# Altium project RetroClock-PCBMAIN.PrjPcb (part 1 of 2)
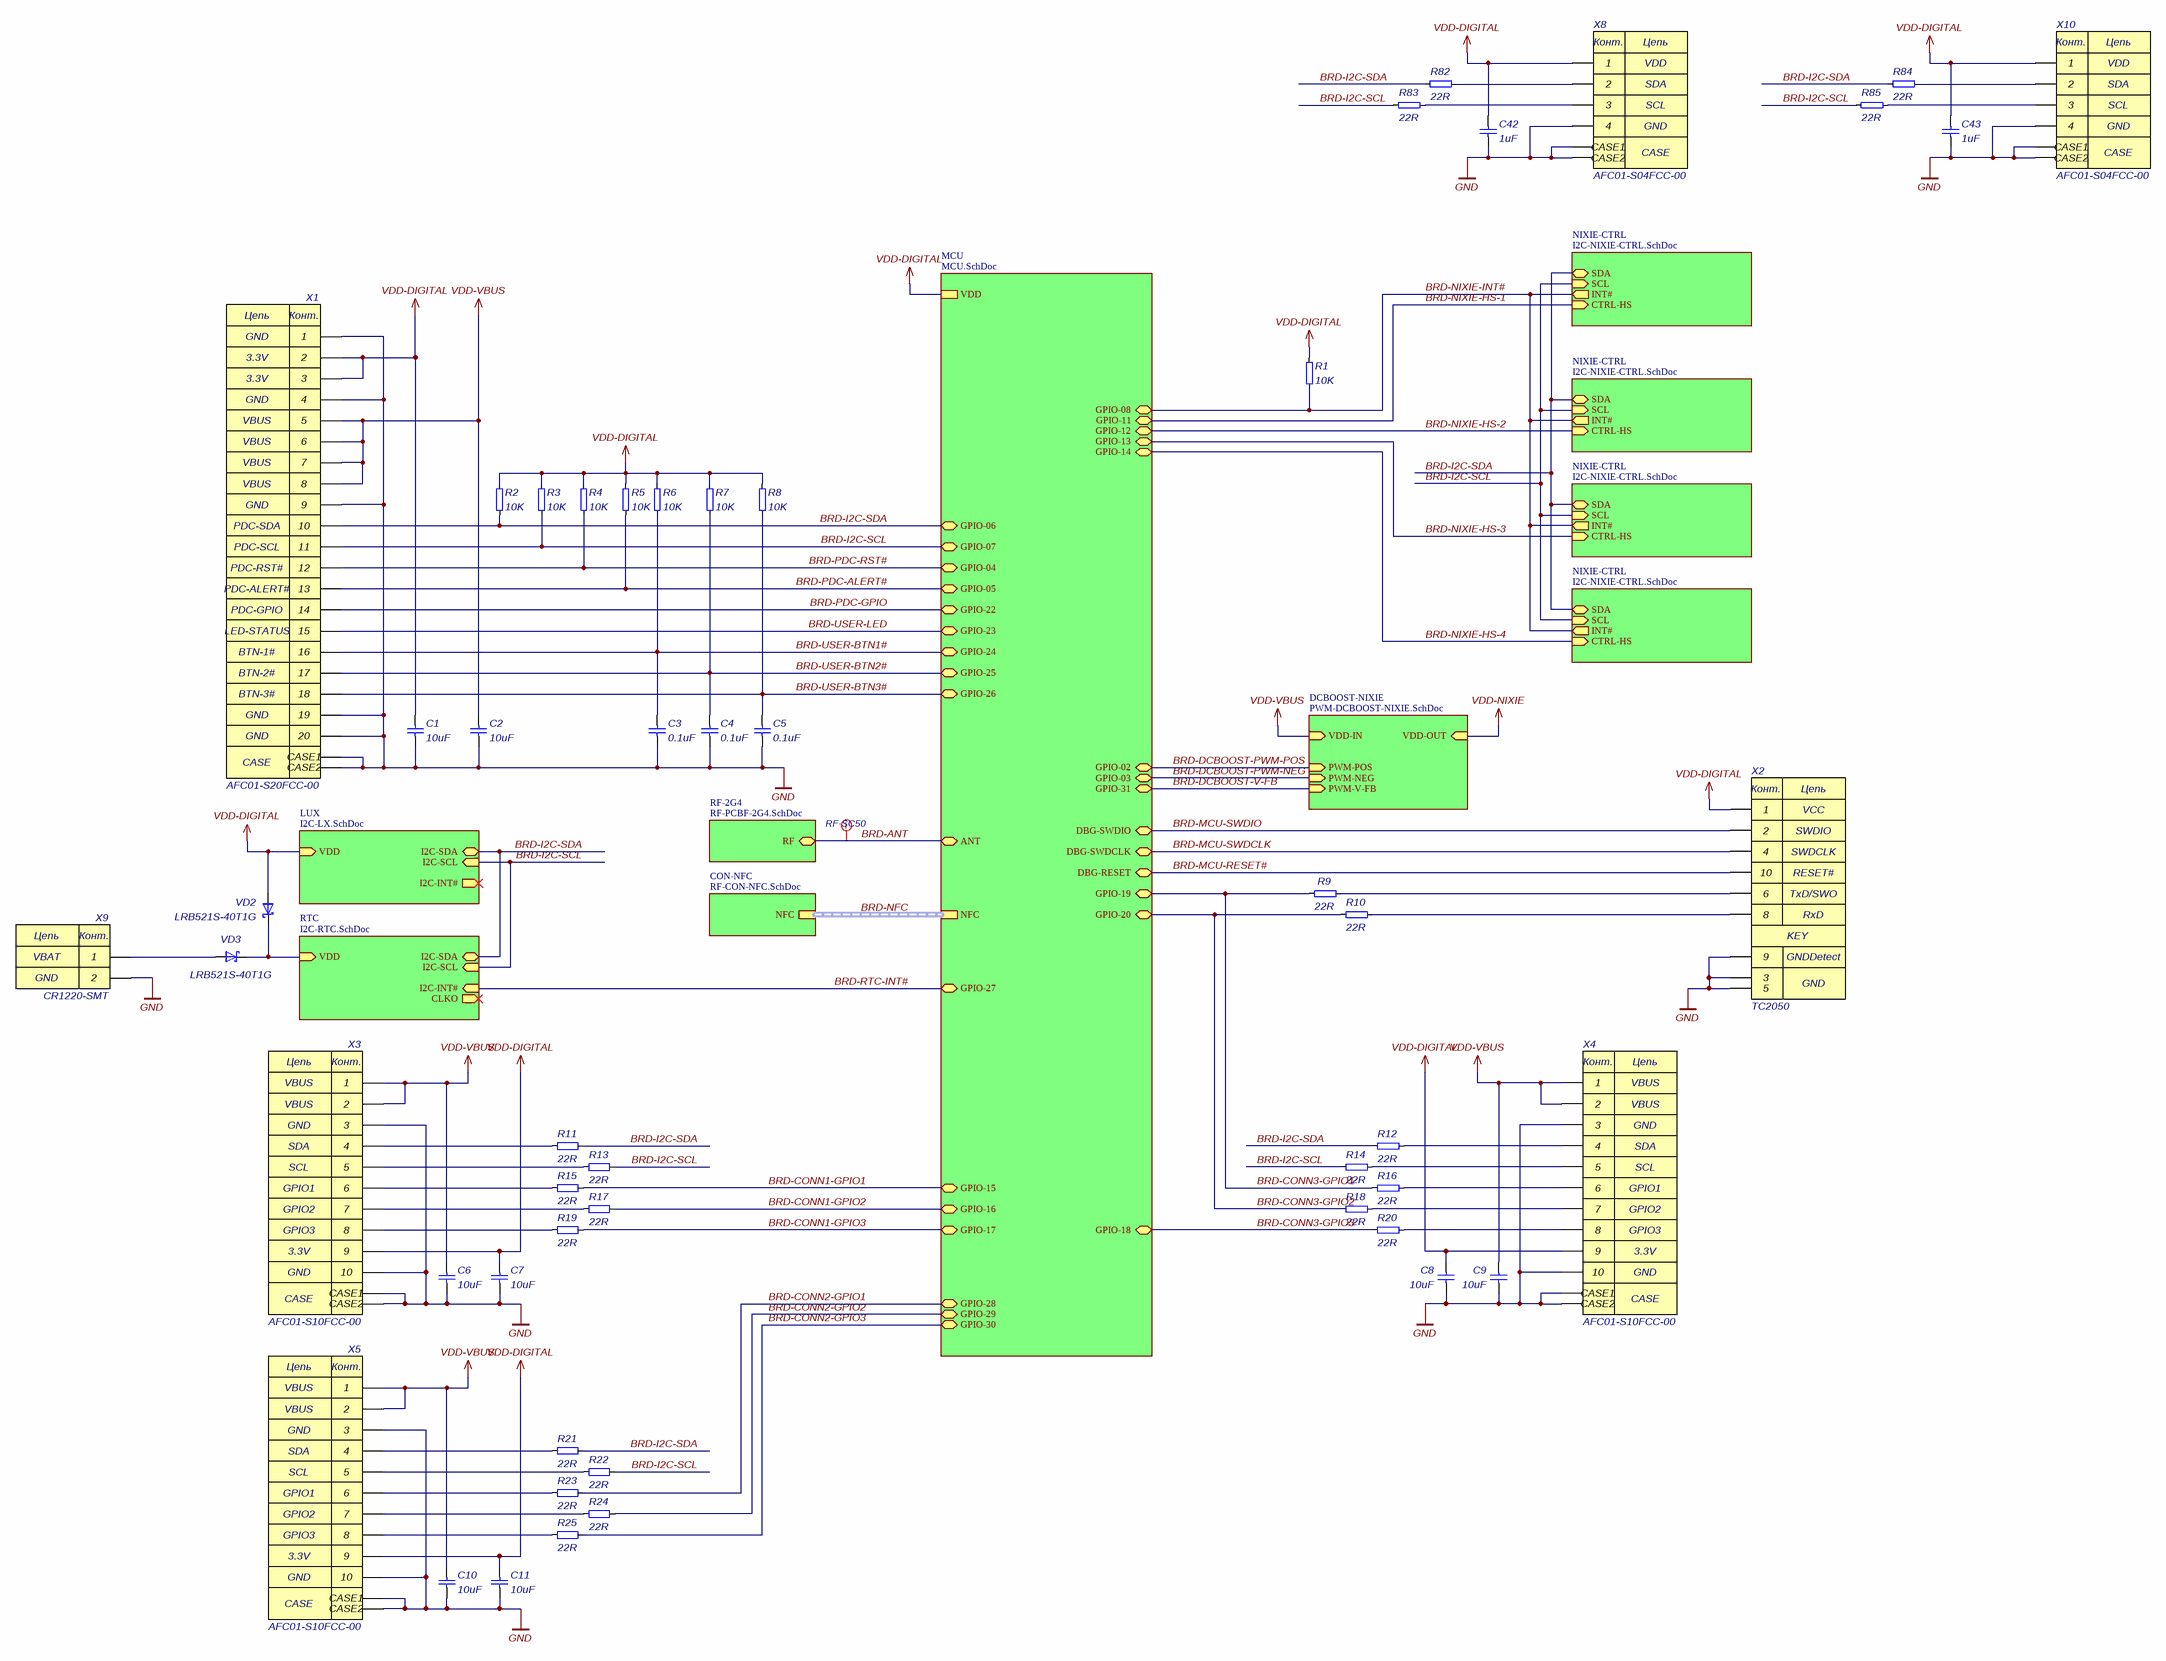
[diagram p0: Board.SchDoc]
ProjectBoardInterface: PRJ; ProjectBoardName: PCBMAIN; ProjectDocumentDescription: Основная плата управления часов с ГРИ; ProjectNumber: RETROCLOCK; ProjectRevision: 1.0; ProjectRevisionCode: A1S3
9 sheets, 364 parts. Net scope: hierarchical (ports join the sheet entries above them; power ports are global).
Board file: PCBMAIN.PcbDoc
Sheets:
  Board.SchDoc
    MCU = MCU.SchDoc
    LUX = I2C-LX.SchDoc
    RTC = I2C-RTC.SchDoc
    NIXIE-CTRL = I2C-NIXIE-CTRL.SchDoc
      EXPANDER = I2C-EXPANDER.SchDoc
    NIXIE-CTRL = I2C-NIXIE-CTRL.SchDoc
      EXPANDER = I2C-EXPANDER.SchDoc
    NIXIE-CTRL = I2C-NIXIE-CTRL.SchDoc
      EXPANDER = I2C-EXPANDER.SchDoc
    NIXIE-CTRL = I2C-NIXIE-CTRL.SchDoc
      EXPANDER = I2C-EXPANDER.SchDoc
    DCBOOST-NIXIE = PWM-DCBOOST-NIXIE.SchDoc
    RF-2G4 = RF-PCBF-2G4.SchDoc
    CON-NFC = RF-CON-NFC.SchDoc

## Sheet Board.SchDoc: =ProjectTitle
size 594 x 420 mm; Address1: Address1; Address2: Address2; Address3: Address3; Address4: Address4; DocumentNumber: PRJ-RETROCLOCK-PCBMAIN-1.0 Э3; SheetNumber: 1; SheetTotal: 9; Scale: 1:1; DocumentType: Схема электрическая принципиальная; FirstReferrence: RETROCLOCK

### Parts
C1  10uF  [C0805]
C2  10uF  [C0805]
C3  0.1uF  [C0402]
C4  0.1uF  [C0402]
C5  0.1uF  [C0402]
C6  10uF  [C0805]
C7  10uF  [C0805]
C8  10uF  [C0805]
C9  10uF  [C0805]
C10  10uF  [C0805]
C11  10uF  [C0805]
C42  1uF  [C0402]
C43  1uF  [C0402]
R1  10K  [R_0402]
R2  10K  [R_0402]
R3  10K  [R_0402]
R4  10K  [R_0402]
R5  10K  [R_0402]
R6  10K  [R_0402]
R7  10K  [R_0402]
R8  10K  [R_0402]
R9  22R  [R_0402]
R10  22R  [R_0402]
R11  22R  [R_0402]
R12  22R  [R_0402]
R13  22R  [R_0402]
R14  22R  [R_0402]
R15  22R  [R_0402]
R16  22R  [R_0402]
R17  22R  [R_0402]
R18  22R  [R_0402]
R19  22R  [R_0402]
R20  22R  [R_0402]
R21  22R  [R_0402]
R22  22R  [R_0402]
R23  22R  [R_0402]
R24  22R  [R_0402]
R25  22R  [R_0402]
R82  22R  [R_0402]
R83  22R  [R_0402]
R84  22R  [R_0402]
R85  22R  [R_0402]
VD2  LRB521S-40T1G  [SOD-523]
VD3  LRB521S-40T1G  [SOD-523]
X1  AFC01-S20FCC-00  [505110-2096]
X2  TC2050  [TC2050-IDC-FP]  (no BOM)
X3  AFC01-S10FCC-00  [505110-1096]
X4  AFC01-S10FCC-00  [505110-1096]
X5  AFC01-S10FCC-00  [505110-1096]
X8  AFC01-S04FCC-00  [505110-0492]
X9  CR1220-SMT  [BAT-HLDR-CR1220-SMT]
X10  AFC01-S04FCC-00  [505110-0492]

### Sub-sheets
CON-NFC = RF-CON-NFC.SchDoc: NFC (harness NFC)
DCBOOST-NIXIE = PWM-DCBOOST-NIXIE.SchDoc: VDD-IN (in), PWM-POS (in), PWM-NEG (in), VDD-OUT (in), PWM-V-FB (in)
LUX = I2C-LX.SchDoc: I2C-SDA (bidir), I2C-SCL (in), VDD (in), I2C-INT# (out)
MCU = MCU.SchDoc: VDD, NFC (harness NFC), ANT (bidir), GPIO-06 (bidir), GPIO-07 (bidir), GPIO-08 (bidir), GPIO-11 (bidir), GPIO-04 (bidir), GPIO-05 (bidir), GPIO-22 (bidir), GPIO-23 (bidir), GPIO-24 (bidir), GPIO-25 (bidir), GPIO-26 (bidir), GPIO-02 (bidir), GPIO-03 (bidir), GPIO-31 (bidir), GPIO-27 (bidir), GPIO-12 (bidir), GPIO-13 (bidir), GPIO-14 (bidir), GPIO-15 (bidir), GPIO-16 (bidir), GPIO-17 (bidir), GPIO-18 (bidir), GPIO-28 (bidir), GPIO-29 (bidir), GPIO-30 (bidir), DBG-SWDIO (bidir), DBG-SWDCLK (bidir), DBG-RESET (bidir), GPIO-19 (bidir), GPIO-20 (bidir)
NIXIE-CTRL = I2C-NIXIE-CTRL.SchDoc: INT# (out), SDA (bidir), SCL (in), CTRL-HS (in)
NIXIE-CTRL = I2C-NIXIE-CTRL.SchDoc: INT# (out), SDA (bidir), SCL (in), CTRL-HS (in)
NIXIE-CTRL = I2C-NIXIE-CTRL.SchDoc: INT# (out), SDA (bidir), SCL (in), CTRL-HS (in)
NIXIE-CTRL = I2C-NIXIE-CTRL.SchDoc: INT# (out), SDA (bidir), SCL (in), CTRL-HS (in)
RF-2G4 = RF-PCBF-2G4.SchDoc: RF (bidir)
RTC = I2C-RTC.SchDoc: I2C-SDA (bidir), I2C-SCL (in), VDD (in), I2C-INT# (in), CLKO (out)

### Nets
GND: C1.2 C2.2 C3.1 C4.1 C5.1 C6.2 C7.2 C8.2 C9.2 C10.2 C11.2 C42.1 C43.1 X1.1 X1.4 X1.9 X1.19 X1.20 X1.CASE1 X1.CASE2 X2.3 X2.5 X2.9 X3.3 X3.10 X3.CASE1 X3.CASE2 X4.3 X4.10 X4.CASE1 X4.CASE2 X5.3 X5.10 X5.CASE1 X5.CASE2 X8.4 X8.CASE1 X8.CASE2 X9.2 X10.4 X10.CASE1 X10.CASE2
VDD-DIGITAL: C1.1 C7.1 C8.1 C11.1 C42.2 C43.2 R1.1 R2.1 R3.1 R4.1 R5.1 R6.1 R7.1 R8.1 VD2.2(A) X1.2 X1.3 X2.1 X3.9 X4.9 X5.9 X8.1 X10.1 ; sheet MCU/VDD, sheet LUX/VDD
VDD-RTC: VD2.1(K) VD3.1(K) ; sheet RTC/VDD
VDD-VBUS: C2.1 C6.1 C9.1 C10.1 X1.5 X1.6 X1.7 X1.8 X3.1 X3.2 X4.1 X4.2 X5.1 X5.2 ; sheet DCBOOST-NIXIE/VDD-IN
BRD-ANT: sheet MCU/ANT, sheet RF-2G4/RF
BRD-CONN1-GPIO1: R15.2 ; sheet MCU/GPIO-15
BRD-CONN1-GPIO2: R17.2 ; sheet MCU/GPIO-16
BRD-CONN1-GPIO3: R19.2 ; sheet MCU/GPIO-17
BRD-CONN2-GPIO1: R23.2 ; sheet MCU/GPIO-28
BRD-CONN2-GPIO2: R24.2 ; sheet MCU/GPIO-29
BRD-CONN2-GPIO3: R25.2 ; sheet MCU/GPIO-30
BRD-CONN3-GPIO1: R9.2 R16.2 ; sheet MCU/GPIO-19
BRD-CONN3-GPIO2: R10.2 R18.2 ; sheet MCU/GPIO-20
BRD-CONN3-GPIO3: R20.2 ; sheet MCU/GPIO-18
BRD-DCBOOST-PWM-NEG: sheet MCU/GPIO-03, sheet DCBOOST-NIXIE/PWM-NEG
BRD-DCBOOST-PWM-POS: sheet MCU/GPIO-02, sheet DCBOOST-NIXIE/PWM-POS
BRD-DCBOOST-V-FB: sheet MCU/GPIO-31, sheet DCBOOST-NIXIE/PWM-V-FB
BRD-I2C-SCL: R3.2 R13.2 R14.2 R22.2 R83.2 R85.2 X1.11 ; sheet MCU/GPIO-07, sheet LUX/I2C-SCL, sheet RTC/I2C-SCL, sheet NIXIE-CTRL/SCL, sheet NIXIE-CTRL/SCL, sheet NIXIE-CTRL/SCL, sheet NIXIE-CTRL/SCL
BRD-I2C-SDA: R2.2 R11.2 R12.2 R21.2 R82.2 R84.2 X1.10 ; sheet MCU/GPIO-06, sheet LUX/I2C-SDA, sheet RTC/I2C-SDA, sheet NIXIE-CTRL/SDA, sheet NIXIE-CTRL/SDA, sheet NIXIE-CTRL/SDA, sheet NIXIE-CTRL/SDA
BRD-MCU-RESET#: X2.10 ; sheet MCU/DBG-RESET
BRD-MCU-SWDCLK: X2.4 ; sheet MCU/DBG-SWDCLK
BRD-MCU-SWDIO: X2.2 ; sheet MCU/DBG-SWDIO
BRD-NIXIE-HS-1: sheet MCU/GPIO-11, sheet NIXIE-CTRL/CTRL-HS
BRD-NIXIE-HS-2: sheet MCU/GPIO-12, sheet NIXIE-CTRL/CTRL-HS
BRD-NIXIE-HS-3: sheet MCU/GPIO-13, sheet NIXIE-CTRL/CTRL-HS
BRD-NIXIE-HS-4: sheet MCU/GPIO-14, sheet NIXIE-CTRL/CTRL-HS
BRD-NIXIE-INT#: R1.2 ; sheet MCU/GPIO-08, sheet NIXIE-CTRL/INT#, sheet NIXIE-CTRL/INT#, sheet NIXIE-CTRL/INT#, sheet NIXIE-CTRL/INT#
BRD-PDC-ALERT#: R5.2 X1.13 ; sheet MCU/GPIO-05
BRD-PDC-GPIO: X1.14 ; sheet MCU/GPIO-22
BRD-PDC-RST#: R4.2 X1.12 ; sheet MCU/GPIO-04
BRD-RTC-INT#: sheet MCU/GPIO-27, sheet RTC/I2C-INT#
BRD-USER-BTN1#: C3.2 R6.2 X1.16 ; sheet MCU/GPIO-24
BRD-USER-BTN2#: C4.2 R7.2 X1.17 ; sheet MCU/GPIO-25
BRD-USER-BTN3#: C5.2 R8.2 X1.18 ; sheet MCU/GPIO-26
BRD-USER-LED: X1.15 ; sheet MCU/GPIO-23
NetR9_1: R9.1 X2.6
NetR10_1: R10.1 X2.8
NetR11_1: R11.1 X3.4
NetR12_1: R12.1 X4.4
NetR13_1: R13.1 X3.5
NetR14_1: R14.1 X4.5
NetR15_1: R15.1 X3.6
NetR16_1: R16.1 X4.6
NetR17_1: R17.1 X3.7
NetR18_1: R18.1 X4.7
NetR19_1: R19.1 X3.8
NetR20_1: R20.1 X4.8
NetR21_1: R21.1 X5.4
NetR22_1: R22.1 X5.5
NetR23_1: R23.1 X5.6
NetR24_1: R24.1 X5.7
NetR25_1: R25.1 X5.8
NetR82_1: R82.1 X8.2
NetR83_1: R83.1 X8.3
NetR84_1: R84.1 X10.2
NetR85_1: R85.1 X10.3
NetVD3_2: VD3.2(A) X9.1

### Buses and harness runs
harness BRD-NFC = sheet CON-NFC/NFC = sheet MCU/NFC

### Layout directives
net class RF-SC50: BRD-ANT

### Notes on the sheet
- VDD
- GND
- SDA
- SCL
- 3.3V
- VBUS
- PDC-SDA
- PDC-SCL
- PDC-RST#
- (near X1) PDC-ALERT#
- PDC-GPIO
- (near X1) LED-STATUS
- BTN-1#
- BTN-2#
- BTN-3#
- VBAT
- GPIO1
- GPIO2
- GPIO3
- Перв. применение
- Справ. №
- Подп. и дата
- Инв. № дубл.
- Взам. инв. №
- File name: =DocumentName
  Variant name (Short): =ProjectVariant ( =ProjectBoardVariant )
  Version on board: =ProjectRevisionCode
- Разраб.
- Изм.
- Лист
- № докум.
- Подп.
- Дата
- Лит.
- Масса
- Масштаб
- Пров.
- Т.контр.
- =ProjectDocumentDescription
- Листов
- Инв. № подл.
- Утв.
- Н.контр.
- Копировал
- Формат А2
- (in symbol AFC01-S04FCC-00) Конт.; Цепь; CASE
- (in symbol AFC01-S10FCC-00) Цепь; Конт.; CASE
- (in symbol AFC01-S20FCC-00) Цепь; Конт.; CASE
- (in symbol L-KLS5-CR1220-02) Цепь; Конт.
- (in symbol PCB-TAGC-10PIN-SWD-UART) Конт.; Цепь; VCC; SWDIO; SWDCLK; RESET#; TxD/SWO; RxD; KEY; GNDDetect; GND

### Library data of the parts
C1 C2 C6-C11 = 0805-X5R-25V-10uF±10%: Manufacturer: Samsung; NameFromManufacturer: CL21A106KAYNNNE; Place: S; Voltage: 25V; Tolerance: 10%; Check: False; Part Number: 0805-X5R-25V-10uF±10%; Value: 10uF; Temperature: -55°C~85°C; ComponentLink2Description: Link to datasheet; ComponentLink1Description: DATASHEET; ComponentLink2URL: https://www.terraelectronica.ru/product/1640984; ComponentLink1URL: Datasheets/capacitors/MLCC-1837944.pdf; Last changed: 27.10.2022
C3-C5 = 0402-X5R-50V-0.1uF±10%: Manufacturer: Yageo; NameFromManufacturer: CC0402KRX5R9BB104; Place: S; Voltage: 50V; Tolerance: 10%; Check: False; Part Number: 0402-X5R-50V-0.1uF±10%; Value: 0.1uF; Temperature: -55°C~85°C; ComponentLink2Description: Link to datasheet; ComponentLink1Description: DATASHEET; ComponentLink2URL: https://www.yageo.com/upload/media/product/productsearch/datasheet/mlcc/UPY-GPHC_X5R_4V-to-50V_26.pdf; ComponentLink1URL: Datasheets/capacitors/UPY-GPHC_X5R_4V-to-50V_26.pdf; Last changed: 27.10.2022
C42 C43 = 0402-X5R-10V-01uF±10%: Manufacturer: Yageo; NameFromManufacturer: CC0402KRX5R6BB105; Place: S; Voltage: 10V; Tolerance: 10%; Check: False; Part Number: 0402-X5R-10V-01uF±10%; Value: 1uF; Temperature: -55°C~85°C; ComponentLink2Description: Link to datasheet; ComponentLink1Description: DATASHEET; ComponentLink2URL: https://ru.mouser.com/ProductDetail/YAGEO/CC0402KRX5R6BB105?qs=%2Fha2pyFadujgDGyIaqGI8b3%252BmgRHwq35%252Bnrnc96EVYSPd2LBZ%2FzpTg%3D%3D; ComponentLink1URL: Datasheets/capacitors/UPY-GPHC_X5R_4V-to-50V_27.pdf; Last changed: 27.10.2022
R1-R8 = 0402-0.0625W-10K-100ppm±1%: NameFromManufacturer: RC0402FR-0710KL; Manufacturer: Yageo; Place: S; Tolerance: 1%; Check: False; Part Number: 0402-0.0625W-10K-100ppm±1%; Value: 10K; Temperature: -55°C~155°C; ComponentLink1Description: DATASHEET; ComponentLink1URL: https://ru.mouser.com/ProductDetail/YAGEO/RC0402FR-0710KL?qs=%2Fha2pyFaduhjtLcYvKXQ8IogF7YwN7YtH%252BOO8ZtEEMnoa4yoWYcwpw%3D%3D; Datasheet: Datasheets/resistors/PYu-RC_Group_51_RoHS_L_11.pdf; Last changed: 27.10.2022
R9-R25 R82-R85 = 0402-0.0625W-22R-100ppm±1%: NameFromManufacturer: RC0402FR-0722RL; Manufacturer: Yageo; Place: S; Tolerance: 1%; Check: False; Part Number: 0402-0.0625W-22R-100ppm±1%; Value: 22R; Temperature: -55°C~155°C; ComponentLink1Description: DATASHEET; ComponentLink1URL: https://www.yageo.com/upload/media/product/productsearch/datasheet/rchip/PYu-RC_Group_51_RoHS_L_11.pdf; Datasheet: Datasheets/resistors/PYu-RC_Group_51_RoHS_L_11.pdf; Last changed: 27.10.2022
VD2 VD3 = LRB521S-40T1G: 40V 300mV 200mA SOD-523 Schottky Barrier Diode; Manufacturer: LRC; Place: T; Analog: NSVRB751S40T1G, 	SDM03U40Q-7; Check: False; Part Number: LRB521S-40T1G; Value: LRB521S-40T1G; Temperature: -55°C~125°C; ComponentLink1Description: DATASHEET; NameFromManufacturer: LRB521S-40T1G; ComponentLink1URL: https://www.lcsc.com/product-detail/Schottky-Barrier-Diodes-SBD_LRC-LRB521S-40T1G_C135802.html; Last changed: 13.03.2024
X1 = AFC01-S20FCC-00: Clamshell -25℃~+85℃ 20P Bottom Contact Surface Mount，Right Angle 0.5mm FFC/FPC Connector; Manufacturer: JUSHUO; Place: T; Check: False; Part Number: AFC01-S20FCC-00; Value: AFC01-S20FCC-00; Temperature: -25°C~85°C; ComponentLink1Description: DATASHEET; NameFromManufacturer: AFC01-S20FCC-00; ComponentLink1URL: https://www.lcsc.com/product-detail/FFC-FPC-Connectors_JUSHUO-AFC01-S20FCC-00_C262274.html; Last changed: 10.03.2024
X2 = PCB-TAGC-10PIN-SWD-UART: TAG Connect 10 pin ARM swd compatilbe with UART; Place: T; Check: False; Part Number: PCB-TAGC-10PIN-SWD-UART; Value: TC2050; ComponentLink1Description: DATASHEET; NameFromManufacturer: *
X3-X5 = AFC01-S10FCC-00: Clamshell -25℃~+85℃ 10P Bottom Contact Surface Mount，Right Angle 0.5mm FFC/FPC Connector; Manufacturer: JUSHUO; Place: T; Check: False; Part Number: AFC01-S10FCC-00; Value: AFC01-S10FCC-00; Temperature: -25°C~85°C; ComponentLink1Description: DATASHEET; NameFromManufacturer: AFC01-S10FCC-00; ComponentLink1URL: https://www.lcsc.com/product-detail/FFC-FPC-Connectors_JUSHUO-AFC01-S10FCC-00_C262266.html; Last changed: 11.03.2024
X8 X10 = AFC01-S04FCC-00: Clamshell 4P Bottom Contact Surface Mount, Right Angle 0.5mm, FFC/FPC Connector; Manufacturer: JUSHUO; Place: T; Check: False; Part Number: AFC01-S04FCC-00; Value: AFC01-S04FCC-00; Temperature: -25°C~85°C; ComponentLink1Description: DATASHEET; NameFromManufacturer: AFC01-S04FCC-00; ComponentLink1URL: https://www.lcsc.com/product-detail/FFC-FPC-Connectors_JUSHUO-AFC01-S04FCC-00_C262260.html; Last changed: 10.03.2024
X9 = L-KLS5-CR1220-02: Battery base -25℃~+85℃ CR1220 SMD Battery Connector; Place: T; Analog: XDCR-1220-006, BS-12-B3AA009; Check: False; Part Number: L-KLS5-CR1220-02; Value: CR1220-SMT; Temperature: -25°C~85°C; ComponentLink1Description: DATASHEET; NameFromManufacturer: L-KLS5-CR1220-02; ComponentLink1URL: https://klsele.com/products/Battery-Connectors-Battery-holders/Coin-Cell-Holders/4669.html; Last changed: 13.03.2024

## Sheet MCU.SchDoc: =ProjectTitle
size 297 x 209 mm; Address1: Address1; Address2: Address2; Address3: Address3; Address4: Address4; DocumentNumber: RETROCLOCK 1.0; SheetNumber: ?; SheetTotal: ?; Scale: 1:1; DocumentType: Схема электрическая принципиальная; FirstReferrence: RETROCLOCK; Title2str: ?
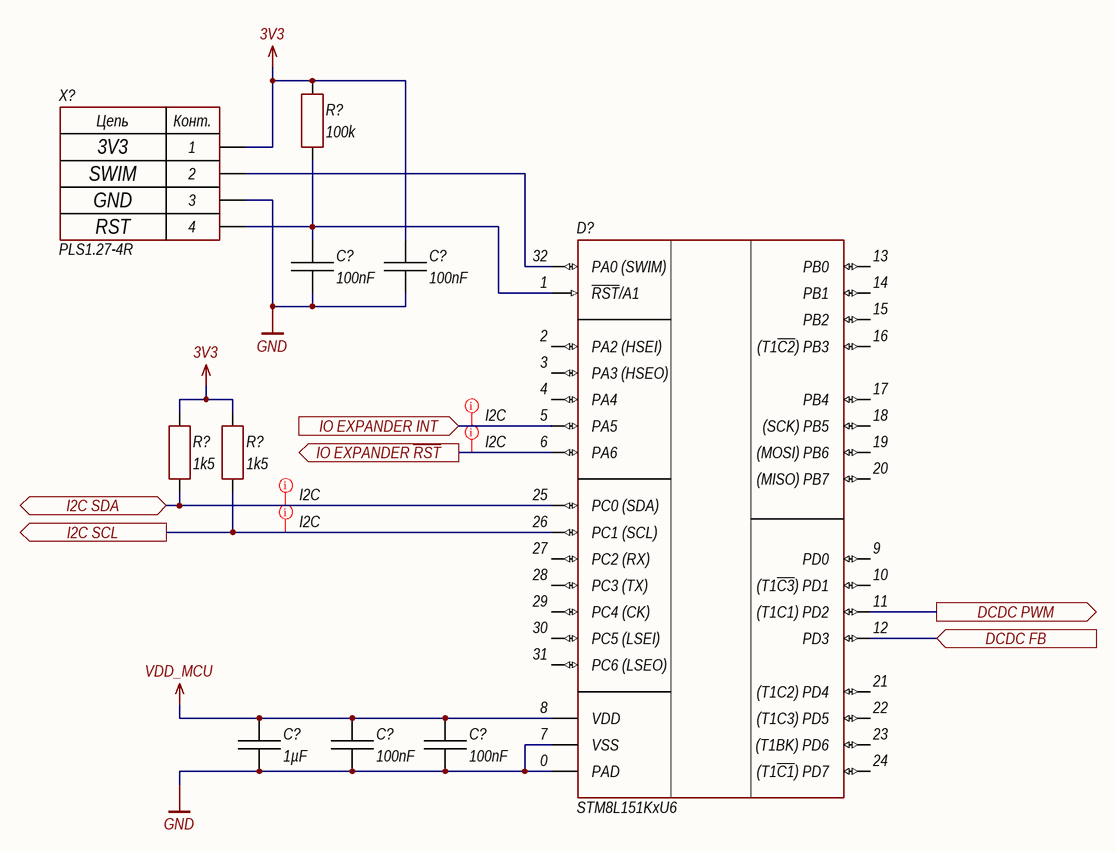
[diagram p1: MCU.SchDoc]

### Parts
(Parts that share a designator on the sheet are numbered #1, #2 ... from top to bottom, then left to right.)
C?#1  100nF  [CH0402C]
C?#2  100nF  [CH0402C]
C?#3  1µF  [CH0402C]
C?#4  100nF  [CH0402C]
C?#5  100nF  [CH0402C]
D?  STM8L151KxU6  [32-UFQFPN]
R?#1  100k  [CH0402R]
R?#2  1k5  [CH0402R]
R?#3  1k5  [CH0402R]
X?  PLS1.27-4R  [CON: PLS1.27-4R]

### Ports
DCDC FB (in), DCDC PWM (out), I2C SCL (out), I2C SDA (bidir), IO EXPANDER INT (in), IO EXPANDER ~{RST} (out)

### Nets
3V3: C?#2.2 R?#1.2 R?#2.2 R?#3.2 X?.1
GND: C?#1.1 C?#2.1 C?#3.1 C?#4.1 C?#5.1 D?.0(PAD) D?.7(VSS) X?.3
VDD_MCU: C?#3.2 C?#4.2 C?#5.2 D?.8(VDD)
DCDC FB: D?.12(PD3) ; port DCDC FB
DCDC PWM: D?.11((T1C1)_PD2) ; port DCDC PWM
I2C SCL: D?.26(PC1_(SCL)) R?#3.1 ; port I2C SCL
I2C SDA: D?.25(PC0_(SDA)) R?#2.1 ; port I2C SDA
IO EXPANDER INT: D?.5(PA5) ; port IO EXPANDER INT
IO EXPANDER ~{RST}: D?.6(PA6) ; port IO EXPANDER ~{RST}
NetC?#1_2: C?#1.2 D?.1(~{RST}/A1) R?#1.1 X?.4
NetD?_32: D?.32(PA0_(SWIM)) X?.2

Not connected (* = marked no-connect by the designer): D? 2(PA2_(HSEI)) 3(PA3_(HSEO)) 4(PA4) 9(PD0) 10((T1~{C3})_PD1) 13(PB0) 14(PB1) 15(PB2) 16((T1~{C2})_PB3) 17(PB4) 18((SCK)_PB5) 19((MOSI)_PB6) 20((MISO)_PB7) 21((T1C2)_PD4) 22((T1C3)_PD5) 23((T1BK)_PD6) 24((T1~{C1})_PD7) 27(PC2_(RX)) 28(PC3_(TX)) 29(PC4_(CK)) 30(PC5_(LSEI)) 31(PC6_(LSEO))

### Layout directives
net class I2C; rule Matched Net Lengths [Tolerance = 0.1mm]: I2C SCL, I2C SDA, IO EXPANDER INT
net class I2C: IO EXPANDER ~{RST}

### Notes on the sheet
- 3V3
- SWIM
- GND
- RST
- Утв.
- Н.контр.
- Т.контр.
- Пров.
- Разраб.
- Изм.
- Лист
- № докум.
- Подп.
- Дата
- Копировал
- Формат А4
- Лит.
- Листов
- Масса
- Масштаб
- (in symbol 4-Connector) Цепь; Конт.

### Library data of the parts
C?#1 C?#2 C?#4 C?#5 = Capacitor: Manufacturer: CCTC; Model: TCC0402X7R104K250AT; HelpURL: https://lcsc.com/product-detail/Multilayer-Ceramic-Capacitors-MLCC-SMD-SMT_CCTC-TCC0402X7R104K250AT_C466234.html; ComponentKind: X7R, 50V; Value: 100nF
C?#3 = Capacitor: Manufacturer: Samsung Electro-Mechanics; Model: CL05B105KQ5NQNC; HelpURL: https://lcsc.com/product-detail/Others_Samsung-Electro-Mechanics_CL05B105KQ5NQNC_Samsung-Electro-Mechanics-CL05B105KQ5NQNC_C307427.html; ComponentKind: X7R, 6.3V; Value: 1µF
D? = STM8L151KxU6: STM8; Manufacturer: ST Microelectronics; Model: STM8L151KxU6; ComponentKind: 1.8-3.6V, UFQFPN32; HelpURL: https://ru.mouser.com/datasheet/2/389/stm8l151c4-956418.pdf
R?#1 = Resistor: Manufacturer: Uniroyal Elec; Model: 0402WGF1003TCE; HelpURL: https://lcsc.com/product-detail/Chip-Resistor-Surface-Mount_UNI-ROYAL-Uniroyal-Elec-0402WGF1003TCE_C25741.html; ComponentKind: ±1%; Value: 100k
R?#2 R?#3 = Resistor: ComponentKind: ±1%; Value: 1k5
X? = 4-Connector: Model: PLS1.27-4R; Manufacturer: *; HelpURL: *; ComponentKind: *

## Sheet I2C-LX.SchDoc: =ProjectTitle
size 209 x 297 mm; Address1: Address1; Address2: Address2; Address3: Address3; Address4: Address4; DocumentNumber: PRJ-RETROCLOCK-PCBMAIN-1.0 Э3; SheetNumber: 3; SheetTotal: 9; Scale: 1:1; DocumentType: Схема электрическая принципиальная; FirstReferrence: RETROCLOCK
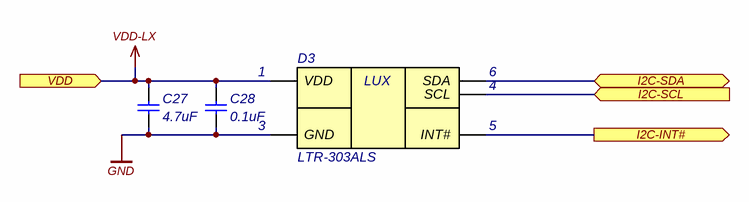
[diagram p2: I2C-LX.SchDoc]

### Parts
C27  4.7uF  [C0402]
C28  0.1uF  [C0402]
D3  LTR-303ALS  [ChipLED-6]

### Ports
I2C-INT# (out), I2C-SCL (in), I2C-SDA (bidir), VDD (in)

### Nets
GND: C27.1 C28.1 D3.3(GND)
VDD-LX: C27.2 C28.2 D3.1(VDD) ; port VDD  [project net VDD-DIGITAL]
BRD-I2C-SCL: D3.4(SCL) ; port I2C-SCL
BRD-I2C-SDA: D3.6(SDA) ; port I2C-SDA
I2C-INT#: D3.5(INT#) ; port I2C-INT#

### Notes on the sheet
- Подп. и дата
- Инв. № дубл.
- Взам. инв. №
- Symbol name: =SheetSymbolDesignator
  File name: =DocumentName
  Variant name (Short): =ProjectVariant ( =ProjectBoardVariant )
  Version on board: =ProjectRevisionCode
- Инв. № подл.
- Изм.
- Лист
- № докум.
- Подп.
- Дата
- 2.106-A4
- Копировал
- Формат А4
- (in symbol LTR-303ALS) LUX

### Library data of the parts
C27 = 0402-X5R-6.3V-4.7uF±20%: Manufacturer: Yageo; NameFromManufacturer: CC0402MRX5R5BB475; Place: S; Voltage: 6.3V; Tolerance: 20%; Check: False; Part Number: 0402-X5R-6.3V-4.7uF±20%; Value: 4.7uF; Temperature: -55°C~125°C; ComponentLink2Description: Link to datasheet; ComponentLink1Description: DATASHEET; ComponentLink2URL: https://ru.mouser.com/ProductDetail/YAGEO/CC0402MRX5R5BB475?qs=%2Fha2pyFadujQAk9rG2cgJpeZ0BKEEZe0MyMZqMwsns5cG502XdwDVw%3D%3D; ComponentLink1URL: Datasheets/capacitors/UPY-GPHC_X5R_4V-to-50V_27.pdf; Last changed: 27.10.2022
C28 = 0402-X7R-16V-0.1uF±10%: Manufacturer: Yageo; NameFromManufacturer: CC0402JRX7R7BB104; Place: S; Voltage: 16V; Tolerance: 5%; Check: False; Annotation: *; Param: *; Value: 0.1uF; Part Number: 0402-X7R-16V-0.1uF±10%; Temperature: -55°C~125°C; ComponentLink1Description: DATASHEET; ComponentLink1URL: https://www.yageo.com/upload/media/product/productsearch/datasheet/mlcc/UPY-GPHC_X7R_6.3V-to-50V_18.pdf; Datasheet: #https://www.yageo.com/upload/media/product/productsearch/datasheet/mlcc/UPY-GPHC_X7R_6.3V-to-50V_18.pdf#; Last changed: 31.03.2021
D3 = LTR-303ALS: I2C Ambient Light Sensor ChipLED-6; Manufacturer: Lite-On; NameFromManufacturer: LTR-303ALS-01; Place: T; Check: False; Part Number: LTR-303ALS; Temperature: -30°C~70°C; Value: LTR-303ALS; ComponentLink1Description: DATASHEET; ComponentLink1URL: https://www.lcsc.com/product-detail/Ambient-Light-Sensors_Lite-On-LTR-303ALS-01_C364577.html; Last changed: 21.01.2024

## Sheet I2C-RTC.SchDoc: =ProjectTitle
size 209 x 297 mm; Scale: 1:1; Address1: Address1; Address2: Address2; Address3: Address3; Address4: Address4; DocumentNumber: PRJ-RETROCLOCK-PCBMAIN-1.0 Э3; SheetNumber: 4; SheetTotal: 9; DocumentType: Схема электрическая принципиальная; FirstReferrence: RETROCLOCK
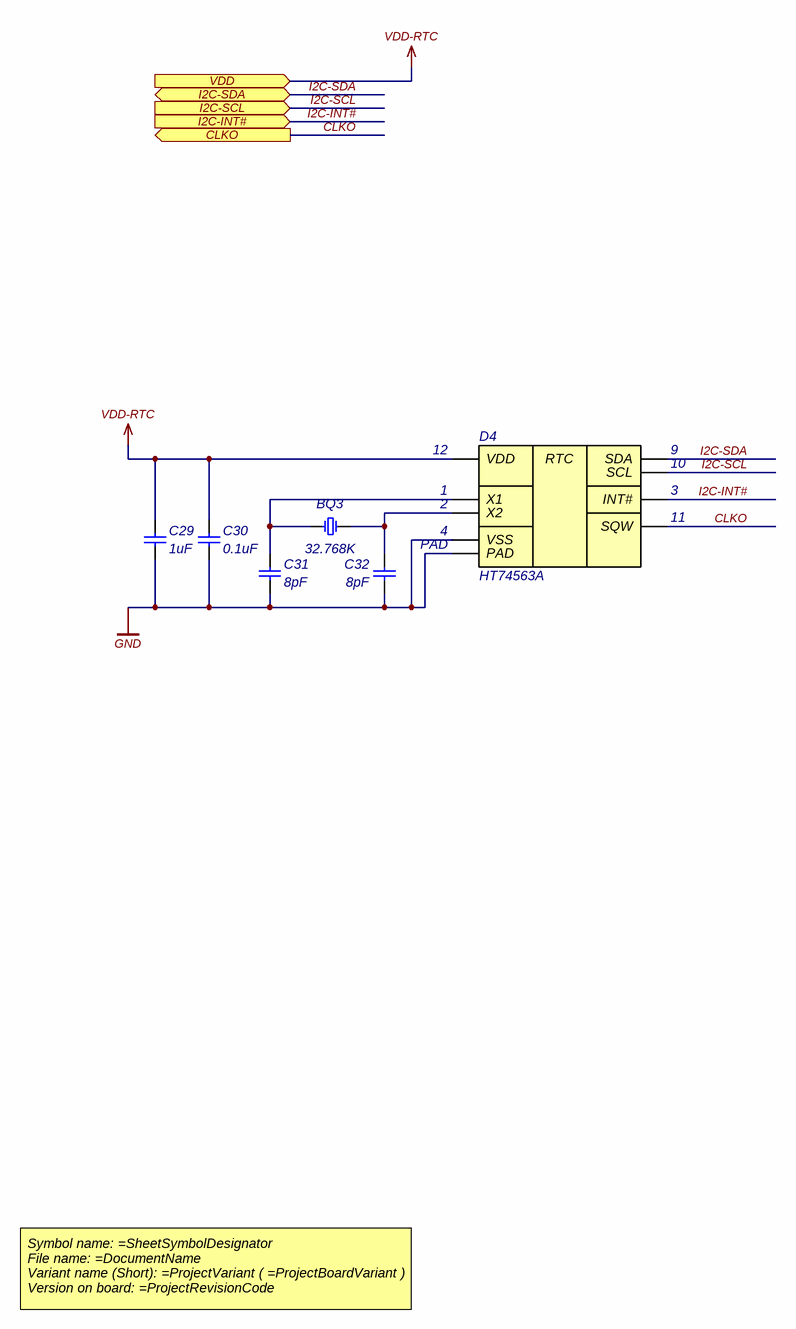
[diagram p3: I2C-RTC.SchDoc]

### Parts
BQ3  32.768K  [SMD1610-2]
C29  1uF  [C0402]
C30  0.1uF  [C0402]
C31  8pF  [C0402]
C32  8pF  [C0402]
D4  HT74563A  [QFN16-3X3P0.5-4X4PAD]

### Ports
CLKO (out), I2C-INT# (in), I2C-SCL (in), I2C-SDA (bidir), VDD (in)

### Nets
GND: C29.2 C30.2 C31.2 C32.2 D4.4(VSS) D4.PAD
VDD-RTC: C29.1 C30.1 D4.12(VDD) ; port VDD
CLKO: D4.11(SQW) ; port CLKO
I2C-INT#: D4.3(INT#) ; port I2C-INT#  [project net BRD-RTC-INT#]
I2C-SCL: D4.10(SCL) ; port I2C-SCL  [project net BRD-I2C-SCL]
I2C-SDA: D4.9(SDA) ; port I2C-SDA  [project net BRD-I2C-SDA]
NetBQ3_1: BQ3.1(inp) C31.1 D4.1(X1)
NetBQ3_2: BQ3.2(out) C32.1 D4.2(X2)

### Notes on the sheet
- Symbol name: =SheetSymbolDesignator
  File name: =DocumentName
  Variant name (Short): =ProjectVariant ( =ProjectBoardVariant )
  Version on board: =ProjectRevisionCode
- Подп. и дата
- Инв. № дубл.
- Взам. инв. №
- Инв. № подл.
- Изм.
- Лист
- № докум.
- Подп.
- Дата
- 2.106-A4
- Копировал
- Формат А4
- (in symbol HT74563A) RTC

### Library data of the parts
BQ3 = SMD1610-32.768K-12.5pF-20ppm: 32.768kHz 12.5pF ±20ppm SMD1610-2PCrystal; Manufacturer: Seiko Epson / Seiko Epson; NameFromManufacturer: X1A0001210005; Place: T; Check: False; Part Number: SMD1610-32.768K-12.5pF-20ppm; Value: 32.768K; Temperature: -40°C~85°C; Tolerance: 20ppm; ComponentLink1Description: DATASHEET; ComponentLink1URL: https://www.lcsc.com/product-detail/SMD-Crystal-Resonators_Seiko-Epson_X1A0001210005_Seiko-Epson-X1A0001210005_C165064.html; Last changed: 04.03.2024
C29 = 0402-X5R-10V-1uF±10%: Manufacturer: Samsung; NameFromManufacturer: CL05A105KP5NNNC; Place: S; Voltage: 10V; Tolerance: 10%; Check: False; Part Number: 0402-X5R-10V-1uF±10%; Value: 1uF; Temperature: -55°C~85°C; ComponentLink2Description: Link to datasheet; ComponentLink1Description: DATASHEET; ComponentLink2URL: https://datasheet.ciiva.com/15195/getdatasheetpartid-358390-15195630.pdf?src-supplier=Verical; ComponentLink1URL: Datasheets/capacitors/getdatasheetpartid-358390-15195630.pdf; Last changed: 27.10.2022
C30 = 0402-X7R-16V-0.1uF±10%: Manufacturer: Yageo; NameFromManufacturer: CC0402JRX7R7BB104; Place: S; Voltage: 16V; Tolerance: 10%; Check: False; Part Number: 0402-X7R-16V-0.1uF±10%; Value: 0.1uF; Temperature: -55°C~125°C; ComponentLink2Description: Link to datasheet; ComponentLink1Description: DATASHEET; ComponentLink2URL: https://www.yageo.com/upload/media/product/productsearch/datasheet/mlcc/UPY-GPHC_X7R_6.3V-to-50V_18.pdf; ComponentLink1URL: Datasheets/capacitors/UPY-GPHC_X7R_6.3V-to-50V_18.pdf; Last changed: 27.10.2022
C31 C32 = 0402-NP0-50V-8pF±0.25pF: Manufacturer: Yageo; NameFromManufacturer: CC0402CRNPO9BN8R0; Place: S; Voltage: 50V; Tolerance: 0.25pF; Check: False; Part Number: 0402-NP0-50V-8pF±0.25pF; Value: 8pF; Temperature: -55°C~125°C; ComponentLink2Description: Link to datasheet; ComponentLink1Description: DATASHEET; ComponentLink2URL: https://www.yageo.com/upload/media/product/productsearch/datasheet/mlcc/UPY-GP_NP0_16V-to-50V_18.pdf; ComponentLink1URL: Datasheets/capacitors/UPY-GP_NP0_16V-to-50V_18.pdf; Last changed: 27.10.2022
D4 = HT74563A: RTC Clock QFN-16; Manufacturer: HTCSEMI; NameFromManufacturer: HT74563ARQZ; Place: T; Check: False; Part Number: HT74563A; Temperature: -40°C~85°C; Value: HT74563A; ComponentLink1Description: DATASHEET; ComponentLink1URL: https://www.lcsc.com/product-detail/Real-time-Clocks-RTC_HTCSEMI-HT74563ARQZ_C3019559.html; Last changed: 21.01.2024

## Sheet I2C-NIXIE-CTRL.SchDoc: =ProjectTitle
size 420 x 297 mm; Address1: Address1; Address2: Address2; Address3: Address3; Address4: Address4; DocumentNumber: PRJ-RETROCLOCK-PCBMAIN-1.0 Э3; SheetNumber: 5; SheetTotal: 9; Scale: 1:1; DocumentType: Схема электрическая принципиальная; FirstReferrence: RETROCLOCK
Used 4 times, as channels NIXIE-CTRL, NIXIE-CTRL, NIXIE-CTRL, NIXIE-CTRL. Parts and nets are listed once, with the designators drawn on the sheet.
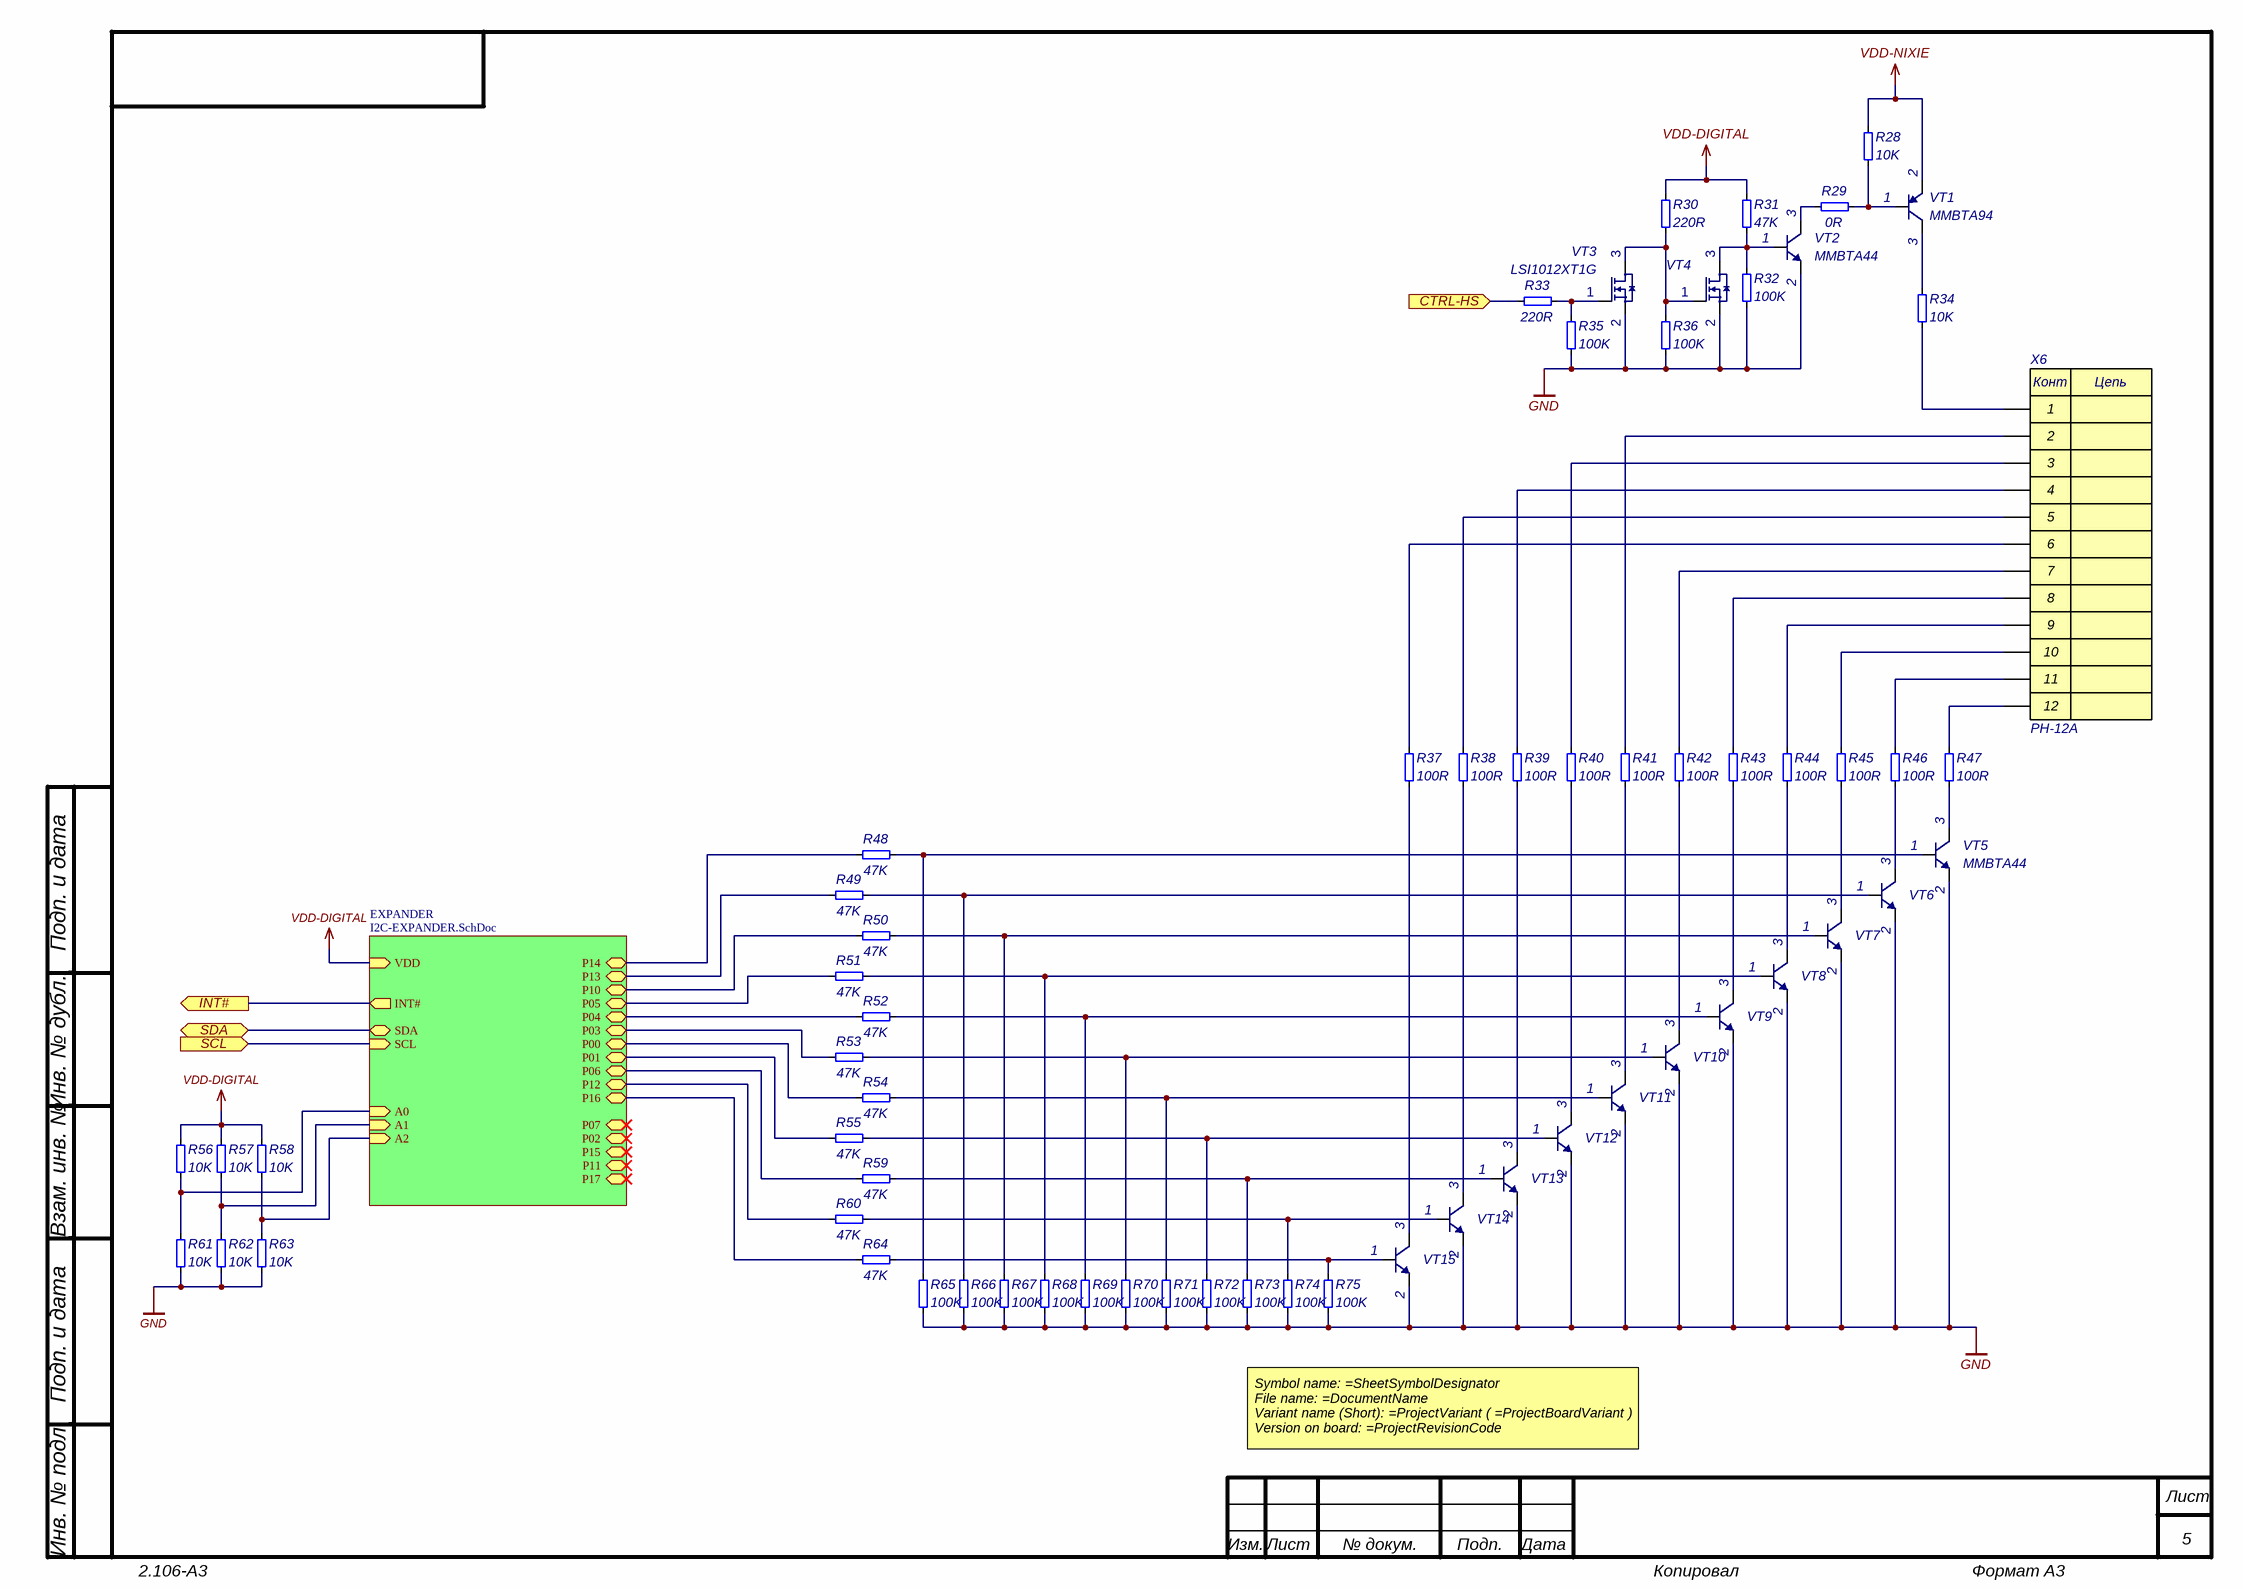
[diagram p4: I2C-NIXIE-CTRL.SchDoc]

### Parts
R28  10K  [R_0805]
R29  0R  [R_0805]
R30  220R  [R_0402]
R31  47K  [R_0402]
R32  100K  [R_0402]
R33  220R  [R_0402]
R34  10K  [R_0805]
R35  100K  [R_0402]
R36  100K  [R_0402]
R37  100R  [R_0805]
R38  100R  [R_0805]
R39  100R  [R_0805]
R40  100R  [R_0805]
R41  100R  [R_0805]
R42  100R  [R_0805]
R43  100R  [R_0805]
R44  100R  [R_0805]
R45  100R  [R_0805]
R46  100R  [R_0805]
R47  100R  [R_0805]
R48  47K  [R_0402]
R49  47K  [R_0402]
R50  47K  [R_0402]
R51  47K  [R_0402]
R52  47K  [R_0402]
R53  47K  [R_0402]
R54  47K  [R_0402]
R55  47K  [R_0402]
R56  10K  [R_0402]
R57  10K  [R_0402]
R58  10K  [R_0402]
R59  47K  [R_0402]
R60  47K  [R_0402]
R61  10K  [R_0402]
R62  10K  [R_0402]
R63  10K  [R_0402]
R64  47K  [R_0402]
R65  100K  [R_0402]
R66  100K  [R_0402]
R67  100K  [R_0402]
R68  100K  [R_0402]
R69  100K  [R_0402]
R70  100K  [R_0402]
R71  100K  [R_0402]
R72  100K  [R_0402]
R73  100K  [R_0402]
R74  100K  [R_0402]
R75  100K  [R_0402]
VT1  MMBTA94  [SOT23]
VT2  MMBTA44  [SOT23]
VT3  LSI1012XT1G  [SC-89]
VT4  LSI1012XT1G  [SC-89]  (value not drawn)
VT5  MMBTA44  [SOT23]
VT6  MMBTA44  [SOT23]  (value not drawn)
VT7  MMBTA44  [SOT23]  (value not drawn)
VT8  MMBTA44  [SOT23]  (value not drawn)
VT9  MMBTA44  [SOT23]  (value not drawn)
VT10  MMBTA44  [SOT23]  (value not drawn)
VT11  MMBTA44  [SOT23]  (value not drawn)
VT12  MMBTA44  [SOT23]  (value not drawn)
VT13  MMBTA44  [SOT23]  (value not drawn)
VT14  MMBTA44  [SOT23]  (value not drawn)
VT15  MMBTA44  [SOT23]  (value not drawn)
X6  PH-12A  [PH-12A]

### Sub-sheets
EXPANDER = I2C-EXPANDER.SchDoc: P00 (bidir), P01 (bidir), P02 (bidir), P03 (bidir), P04 (bidir), P05 (bidir), P06 (bidir), P07 (bidir), P10 (bidir), P11 (bidir), P12 (bidir), SDA (bidir), SCL (in), INT# (out), VDD (in), A0 (in), A1 (in), A2 (in), P13 (bidir), P14 (bidir), P15 (bidir), P16 (bidir), P17 (bidir)

### Ports
CTRL-HS (in), INT# (out), SCL (in), SDA (bidir)

### Nets
GND: R32.2 R35.2 R36.2 R61.1 R62.1 R63.1 R65.2 R66.2 R67.2 R68.2 R69.2 R70.2 R71.2 R72.2 R73.2 R74.2 R75.2 VT2.2(E) VT3.2(S) VT4.2(S) VT5.2(E) VT6.2(E) VT7.2(E) VT8.2(E) VT9.2(E) VT10.2(E) VT11.2(E) VT12.2(E) VT13.2(E) VT14.2(E) VT15.2(E)
VDD-DIGITAL: R30.1 R31.1 R56.2 R57.2 R58.2 ; sheet EXPANDER/VDD
VDD-NIXIE: R28.1 VT1.2(E)
CTRL-HS: R33.1 ; port CTRL-HS
INT#: port INT#, sheet EXPANDER/INT#
SCL: port SCL, sheet EXPANDER/SCL
SDA: port SDA, sheet EXPANDER/SDA
NetR28_2: R28.2 R29.2 VT1.1(B)
NetR29_1: R29.1 VT2.3(C)
NetR30_2: R30.2 R36.1 VT3.3(D) VT4.1(G)
NetR31_2: R31.2 R32.1 VT2.1(B) VT4.3(D)
NetR33_2: R33.2 R35.1 VT3.1(G)
NetR34_1: R34.1 VT1.3(C)
NetR34_2: R34.2 X6.1
NetR37_1: R37.1 X6.6
NetR37_2: R37.2 VT15.3(C)
NetR38_1: R38.1 X6.5
NetR38_2: R38.2 VT14.3(C)
NetR39_1: R39.1 X6.4
NetR39_2: R39.2 VT13.3(C)
NetR40_1: R40.1 X6.3
NetR40_2: R40.2 VT12.3(C)
NetR41_1: R41.1 X6.2
NetR41_2: R41.2 VT11.3(C)
NetR42_1: R42.1 X6.7
NetR42_2: R42.2 VT10.3(C)
NetR43_1: R43.1 X6.8
NetR43_2: R43.2 VT9.3(C)
NetR44_1: R44.1 X6.9
NetR44_2: R44.2 VT8.3(C)
NetR45_1: R45.1 X6.10
NetR45_2: R45.2 VT7.3(C)
NetR46_1: R46.1 X6.11
NetR46_2: R46.2 VT6.3(C)
NetR47_1: R47.1 X6.12
NetR47_2: R47.2 VT5.3(C)
NetR48_1: R48.1 ; sheet EXPANDER/P14
NetR48_2: R48.2 R65.1 VT5.1(B)
NetR49_1: R49.1 ; sheet EXPANDER/P13
NetR49_2: R49.2 R66.1 VT6.1(B)
NetR50_1: R50.1 ; sheet EXPANDER/P10
NetR50_2: R50.2 R67.1 VT7.1(B)
NetR51_1: R51.1 ; sheet EXPANDER/P05
NetR51_2: R51.2 R68.1 VT8.1(B)
NetR52_1: R52.1 ; sheet EXPANDER/P04
NetR52_2: R52.2 R69.1 VT9.1(B)
NetR53_1: R53.1 ; sheet EXPANDER/P03
NetR53_2: R53.2 R70.1 VT10.1(B)
NetR54_1: R54.1 ; sheet EXPANDER/P00
NetR54_2: R54.2 R71.1 VT11.1(B)
NetR55_1: R55.1 ; sheet EXPANDER/P01
NetR55_2: R55.2 R72.1 VT12.1(B)
NetR56_1: R56.1 R61.2 ; sheet EXPANDER/A0
NetR57_1: R57.1 R62.2 ; sheet EXPANDER/A1
NetR58_1: R58.1 R63.2 ; sheet EXPANDER/A2
NetR59_1: R59.1 ; sheet EXPANDER/P06
NetR59_2: R59.2 R73.1 VT13.1(B)
NetR60_1: R60.1 ; sheet EXPANDER/P12
NetR60_2: R60.2 R74.1 VT14.1(B)
NetR64_1: R64.1 ; sheet EXPANDER/P16
NetR64_2: R64.2 R75.1 VT15.1(B)

### Channels
NIXIE-CTRL: designators end in _NIXIE-CTRL#1; ports CTRL-HS=BRD-NIXIE-HS-1 INT#=BRD-NIXIE-INT# SCL=BRD-I2C-SCL SDA=BRD-I2C-SDA
NIXIE-CTRL: designators end in _NIXIE-CTRL#2; ports CTRL-HS=BRD-NIXIE-HS-2 INT#=BRD-NIXIE-INT# SCL=BRD-I2C-SCL SDA=BRD-I2C-SDA
NIXIE-CTRL: designators end in _NIXIE-CTRL#3; ports CTRL-HS=BRD-NIXIE-HS-3 INT#=BRD-NIXIE-INT# SCL=BRD-I2C-SCL SDA=BRD-I2C-SDA
NIXIE-CTRL: designators end in _NIXIE-CTRL#4; ports CTRL-HS=BRD-NIXIE-HS-4 INT#=BRD-NIXIE-INT# SCL=BRD-I2C-SCL SDA=BRD-I2C-SDA

### Notes on the sheet
- Подп. и дата
- Инв. № дубл.
- Взам. инв. №
- Symbol name: =SheetSymbolDesignator
  File name: =DocumentName
  Variant name (Short): =ProjectVariant ( =ProjectBoardVariant )
  Version on board: =ProjectRevisionCode
- Инв. № подл.
- Изм.
- Лист
- № докум.
- Подп.
- Дата
- 2.106-A3
- Копировал
- Формат А3
- (in symbol PH-12A) Конт; Цепь

### Library data of the parts
R28 R34 = 0805-0.125W-10K-200ppm±1%: NameFromManufacturer: RC0805FR-0710KL; Manufacturer: Yageo; Place: T; Tolerance: 1%; Check: False; Part Number: 0805-0.125W-10K-200ppm±1%; Value: 10K; Temperature: -55°C~155°C; ComponentLink1Description: DATASHEET; ComponentLink1URL: https://static.chipdip.ru/lib/175/DOC011175144.pdf; Datasheet: Datasheets/resistors/PYu-RC_Group_51_RoHS_L_11.pdf; Last changed: 22.01.2024
R29 = 0805-0.125W-0R-250ppm±5%: NameFromManufacturer: RC0805JR-070RL; Manufacturer: Yageo; Place: S; Tolerance: 5%; Check: False; Part Number: 0805-0.125W-0R-250ppm±5%; Value: 0R; Temperature: -55°C~155°C; ComponentLink1Description: DATASHEET; ComponentLink1URL: https://www.terraelectronica.ru/product/327233; Datasheet: Datasheets/resistors/PYu-RC_Group_51_RoHS_L_11.pdf; Last changed: 27.10.2022
R30 R33 = 0402-0.0625W-220R-100ppm±1%: NameFromManufacturer: RC0402FR-07220RL; Manufacturer: Yageo; Place: S; Tolerance: 1%; Check: False; Part Number: 0402-0.0625W-220R-100ppm±1%; Value: 220R; Temperature: -55°C~155°C; ComponentLink1Description: DATASHEET; ComponentLink1URL: https://octopart.com/rc0402jr-07220rl-yageo-40254879?r=sp#Specs; Datasheet: Datasheets/resistors/RC0402.pdf; Last changed: 28.03.2023
R31 R48-R55 R59 R60 R64 = 0402-0.0625W-47K-100ppm±1%: NameFromManufacturer: RC0402FR-0747KL; Manufacturer: Yageo; Place: S; Tolerance: 1%; Check: False; Part Number: 0402-0.0625W-47K-100ppm±1%; Value: 47K; Temperature: -55°C~155°C; ComponentLink1Description: DATASHEET; ComponentLink1URL: https://www.terraelectronica.ru/pdf/show?pdf_file=%252Fds%252Fpdf%252FR%252FRC0402.pdf; Datasheet: Datasheets/resistors/PYu-RC_Group_51_RoHS_L_12.pdf; Last changed: 27.10.2022
R32 R35 R36 R65-R75 = 0402-0.0625W-100K-100ppm±1%: NameFromManufacturer: RC0402FR-07100KL; Manufacturer: Yageo; Place: S; Tolerance: 1%; Check: False; Part Number: 0402-0.0625W-100K-100ppm±1%; Value: 100K; Temperature: -55°C~155°C; ComponentLink1Description: DATASHEET; ComponentLink1URL: https://www.yageo.com/upload/media/product/productsearch/datasheet/rchip/PYu-RC_Group_51_RoHS_L_11.pdf; Datasheet: Datasheets/resistors/PYu-RC_Group_51_RoHS_L_11.pdf; Last changed: 27.10.2022
R37-R47 = 0805-0.125W-100R-100ppm±1%: *; NameFromManufacturer: RC0805FR-07100RL; Manufacturer: Yageo; Place: S; Tolerance: 1%; Check: False; Part Number: 0805-0.125W-100R-100ppm±1%; Value: 100R; Temperature: -55°C~125°C; ComponentLink1Description: DATASHEET; ComponentLink1URL: https://eu.mouser.com/ProductDetail/YAGEO/RC0805FR-07100RL?qs=8Y8p%252BasKcI6MtXUgG4E6SQ%3D%3D; Datasheet: Datasheets/resistors/PYu-RC_Group_51_RoHS_L_11.pdf; Last changed: 27.10.2022
R56-R58 R61-R63 = 0402-0.0625W-10K-100ppm±1%: as R1 on sheet Board; Part Number: 0402-0.0625W-10K-100ppm±1%; Value: 10K; Temperature: -55°C~155°C; ComponentLink1Description: DATASHEET; ComponentLink1URL: https://ru.mouser.com/ProductDetail/YAGEO/RC0402FR-0710KL?qs=%2Fha2pyFaduhjtLcYvKXQ8IogF7YwN7YtH%252BOO8ZtEEMnoa4yoWYcwpw%3D%3D; Datasheet: Datasheets/resistors/PYu-RC_Group_51_RoHS_L_11.pdf; Last changed: 27.10.2022
VT1 = MMBTA94: 400V 350mW 300mA PNP SOT-23 Bipolar Transistor; Manufacturer: PJSEMI; Place: T; Check: False; Part Number: MMBTA94; Voltage: 400V; Value: MMBTA94; Temperature: -55°C~150°C; ComponentLink1Description: DATASHEET; NameFromManufacturer: MMBTA94; ComponentLink1URL: https://www.lcsc.com/product-detail/Bipolar-Transistors-BJT_PJSEMI-MMBTA94_C411780.html; Last changeв: 21.01.2024
VT2 VT5-VT15 = MMBTA44: 400V 350mW 300mA NPN SOT-23 Bipolar Transistor; Manufacturer: PJSEMI; Place: T; Check: False; Part Number: MMBTA44; Voltage: 400V; Value: MMBTA44; Temperature: -55°C~150°C; ComponentLink1Description: DATASHEET; NameFromManufacturer: MMBTA44; ComponentLink1URL: https://www.lcsc.com/product-detail/Bipolar-Transistors-BJT_PJSEMI-MMBTA44_C411777.html; Last changeв: 21.01.2024
VT3 VT4 = LSI1012XT1G: 20V 500mA 250mW, 900mV@250uA N Channel SC-89 MOSFET; Manufacturer: LRC; Place: T; Check: False; Part Number: LSI1012XT1G; Voltage: 20V; Value: LSI1012XT1G; Temperature: -55°C~150°C; ComponentLink1Description: DATASHEET; NameFromManufacturer: LSI1012XT1G; ComponentLink1URL: https://www.lcsc.com/product-detail/MOSFETs_LRC-LSI1012XT1G_C383275.html; Last changeв: 11.03.2024
X6 = PH-12A: 12P PH 2mm 3A Straight P=2mm; Manufacturer: HCTL; Place: T; Check: False; Part Number: PH-12A; Value: PH-12A; Temperature: -20°C~85°C; ComponentLink1Description: DATASHEET; NameFromManufacturer: PH-12A; ComponentLink1URL: https://www.lcsc.com/product-detail/Wire-To-Board-Wire-To-Wire-Connector_HCTL-PH-12A_C2908633.html; Last changed: 21.01.2024

## Sheet I2C-EXPANDER.SchDoc: =ProjectTitle
size 209 x 297 mm; Scale: 1:1; Address1: Address1; Address2: Address2; Address3: Address3; Address4: Address4; DocumentNumber: PRJ-RETROCLOCK-PCBMAIN-1.0 Э3; SheetNumber: 6; SheetTotal: 9; DocumentType: Схема электрическая принципиальная; FirstReferrence: RETROCLOCK
Used 4 times, as channels NIXIE-CTRL/EXPANDER, NIXIE-CTRL/EXPANDER, NIXIE-CTRL/EXPANDER, NIXIE-CTRL/EXPANDER. Parts and nets are listed once, with the designators drawn on the sheet.
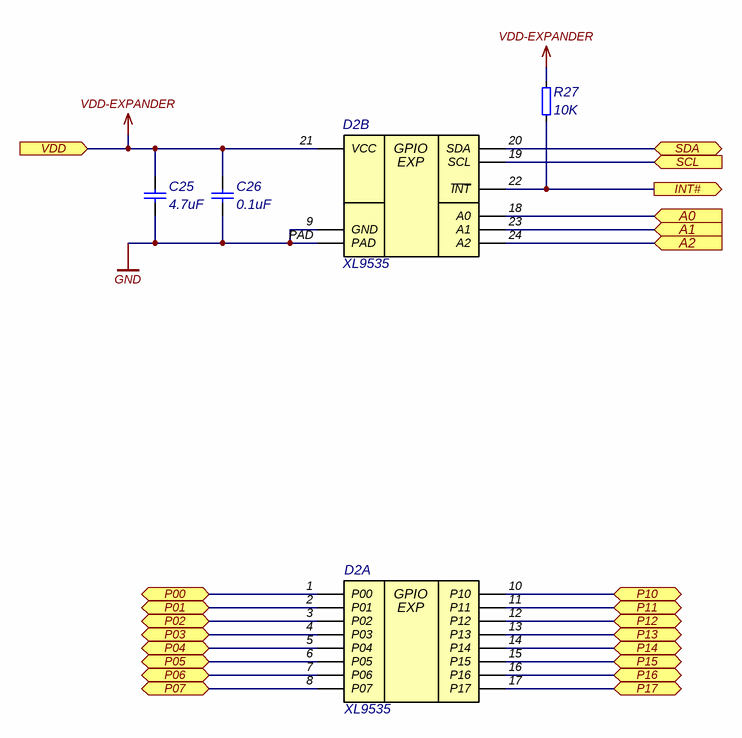
[diagram p5: I2C-EXPANDER.SchDoc]

### Parts
C25  4.7uF  [C0402]
C26  0.1uF  [C0402]
D2  XL9535  [QFN_24_4X4_E0p5]  (parts A,B of 2)
R27  10K  [R_0402]

### Ports
A0 (in), A1 (in), A2 (in), INT# (out), P00 (bidir), P01 (bidir), P02 (bidir), P03 (bidir), P04 (bidir), P05 (bidir), P06 (bidir), P07 (bidir), P10 (bidir), P11 (bidir), P12 (bidir), P13 (bidir), P14 (bidir), P15 (bidir), P16 (bidir), P17 (bidir), SCL (in), SDA (bidir), VDD (in)

### Nets
GND: C25.1 C26.1 D2.9(GND) D2.PAD
VDD-EXPANDER: C25.2 C26.2 D2.21(VCC) R27.2 ; port VDD
A0: D2.18(A0) ; port A0
A1: D2.23(A1) ; port A1
A2: D2.24(A2) ; port A2
INT#: D2.22(~{INT}) R27.1 ; port INT#
P00: D2.1(P00) ; port P00
P01: D2.2(P01) ; port P01
P02: D2.3(P02) ; port P02
P03: D2.4(P03) ; port P03
P04: D2.5(P04) ; port P04
P05: D2.6(P05) ; port P05
P06: D2.7(P06) ; port P06
P07: D2.8(P07) ; port P07
P10: D2.10(P10) ; port P10
P11: D2.11(P11) ; port P11
P12: D2.12(P12) ; port P12
P13: D2.13(P13) ; port P13
P14: D2.14(P14) ; port P14
P15: D2.15(P15) ; port P15
P16: D2.16(P16) ; port P16
P17: D2.17(P17) ; port P17
SCL: D2.19(SCL) ; port SCL
SDA: D2.20(SDA) ; port SDA

### Channels
NIXIE-CTRL/EXPANDER: designators end in _NIXIE-CTRL_EXPANDER#1; ports A0=A0 A1=A1 A2=A2 INT#=BRD-NIXIE-INT# P00=P00 P01=P01 P02=P02_EXPANDER P03=P03 P04=P04 P05=P05 P06=P06 P07=P07_EXPANDER P10=P10 P11=P11_EXPANDER P12=P12 P13=P13 P14=P14 P15=P15_EXPANDER P16=P16 P17=P17_EXPANDER SCL=BRD-I2C-SCL SDA=BRD-I2C-SDA VDD=VDD-DIGITAL
NIXIE-CTRL/EXPANDER: designators end in _NIXIE-CTRL_EXPANDER#2; ports A0=A0 A1=A1 A2=A2 INT#=BRD-NIXIE-INT# P00=P00 P01=P01 P02=P02_EXPANDER P03=P03 P04=P04 P05=P05 P06=P06 P07=P07_EXPANDER P10=P10 P11=P11_EXPANDER P12=P12 P13=P13 P14=P14 P15=P15_EXPANDER P16=P16 P17=P17_EXPANDER SCL=BRD-I2C-SCL SDA=BRD-I2C-SDA VDD=VDD-DIGITAL
NIXIE-CTRL/EXPANDER: designators end in _NIXIE-CTRL_EXPANDER#3; ports A0=A0 A1=A1 A2=A2 INT#=BRD-NIXIE-INT# P00=P00 P01=P01 P02=P02_EXPANDER P03=P03 P04=P04 P05=P05 P06=P06 P07=P07_EXPANDER P10=P10 P11=P11_EXPANDER P12=P12 P13=P13 P14=P14 P15=P15_EXPANDER P16=P16 P17=P17_EXPANDER SCL=BRD-I2C-SCL SDA=BRD-I2C-SDA VDD=VDD-DIGITAL
NIXIE-CTRL/EXPANDER: designators end in _NIXIE-CTRL_EXPANDER#4; ports A0=A0 A1=A1 A2=A2 INT#=BRD-NIXIE-INT# P00=P00 P01=P01 P02=P02_EXPANDER P03=P03 P04=P04 P05=P05 P06=P06 P07=P07_EXPANDER P10=P10 P11=P11_EXPANDER P12=P12 P13=P13 P14=P14 P15=P15_EXPANDER P16=P16 P17=P17_EXPANDER SCL=BRD-I2C-SCL SDA=BRD-I2C-SDA VDD=VDD-DIGITAL

### Notes on the sheet
- Подп. и дата
- Инв. № дубл.
- Взам. инв. №
- Symbol name: =SheetSymbolDesignator
  File name: =DocumentName
  Variant name (Short): =ProjectVariant ( =ProjectBoardVariant )
  Version on board: =ProjectRevisionCode
- Инв. № подл.
- Изм.
- Лист
- № докум.
- Подп.
- Дата
- 2.106-A4
- Копировал
- Формат А4
- (in symbol XL9535QF24, part A) GPIO; EXP
- (in symbol XL9535QF24, part B) GPIO; EXP

### Library data of the parts
C25 = 0402-X5R-6.3V-4.7uF±20%: as C27 on sheet I2C-LX; Part Number: 0402-X5R-6.3V-4.7uF±20%; Value: 4.7uF; Temperature: -55°C~125°C; ComponentLink2Description: Link to datasheet; ComponentLink1Description: DATASHEET; ComponentLink2URL: https://ru.mouser.com/ProductDetail/YAGEO/CC0402MRX5R5BB475?qs=%2Fha2pyFadujQAk9rG2cgJpeZ0BKEEZe0MyMZqMwsns5cG502XdwDVw%3D%3D; ComponentLink1URL: Datasheets/capacitors/UPY-GPHC_X5R_4V-to-50V_27.pdf; Last changed: 27.10.2022
C26 = 0402-X7R-16V-0.1uF±10%: as C28 on sheet I2C-LX; Annotation: *; Param: *; Value: 0.1uF; Part Number: 0402-X7R-16V-0.1uF±10%; Temperature: -55°C~125°C; ComponentLink1Description: DATASHEET; ComponentLink1URL: https://www.yageo.com/upload/media/product/productsearch/datasheet/mlcc/UPY-GPHC_X7R_6.3V-to-50V_18.pdf; Datasheet: #https://www.yageo.com/upload/media/product/productsearch/datasheet/mlcc/UPY-GPHC_X7R_6.3V-to-50V_18.pdf#; Last changed: 31.03.2021
D2 = XL9535QF24: I2C  I/O Expander 16 bit; Manufacturer: XINLUDA; Place: T; Analog: TCA9535RTWR; Check: False; Part Number: XL9535QF24; Temperature: -40°C~85°C; Value: XL9535; ComponentLink1Description: DATASHEET; NameFromManufacturer: XL9535QF24; ComponentLink1URL: https://datasheet.lcsc.com/lcsc/2304251416_XINLUDA-XL9535QF24_C5444301.pdf; Last changed: 17.10.2023
R27 = 0402-0.0625W-10K-100ppm±1%: as R1 on sheet Board; Part Number: 0402-0.0625W-10K-100ppm±1%; Value: 10K; Temperature: -55°C~155°C; ComponentLink1Description: DATASHEET; ComponentLink1URL: https://ru.mouser.com/ProductDetail/YAGEO/RC0402FR-0710KL?qs=%2Fha2pyFaduhjtLcYvKXQ8IogF7YwN7YtH%252BOO8ZtEEMnoa4yoWYcwpw%3D%3D; Datasheet: Datasheets/resistors/PYu-RC_Group_51_RoHS_L_11.pdf; Last changed: 27.10.2022

## Sheet PWM-DCBOOST-NIXIE.SchDoc: =ProjectTitle
size 209 x 297 mm; Scale: 1:1; Address1: Address1; Address2: Address2; Address3: Address3; Address4: Address4; DocumentNumber: PRJ-RETROCLOCK-PCBMAIN-1.0 Э3; SheetNumber: 7; SheetTotal: 9; DocumentType: Схема электрическая принципиальная; FirstReferrence: RETROCLOCK
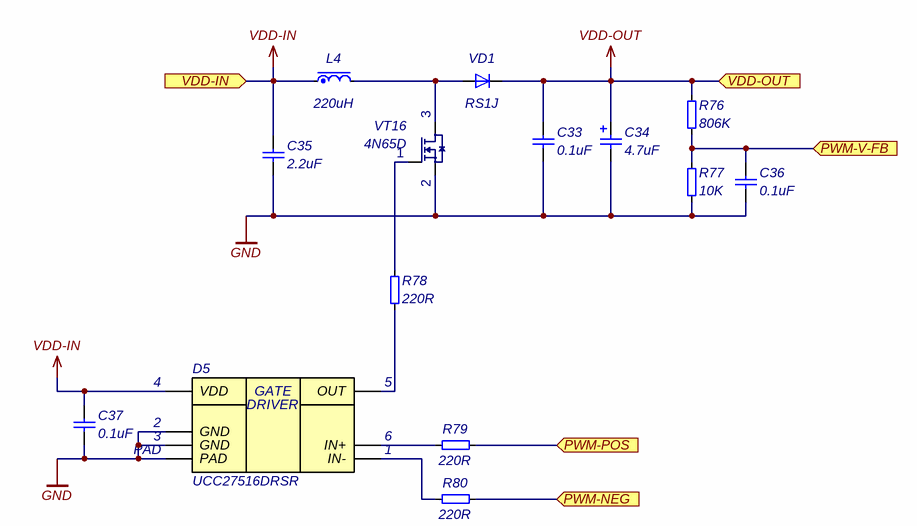
[diagram p6: PWM-DCBOOST-NIXIE.SchDoc]

### Parts
C33  0.1uF  [C1210]
C34  4.7uF  [SMD_8X10.5MM]
C35  2.2uF  [C1210]
C36  0.1uF  [C0402]
C37  0.1uF  [C0402]
D5  UCC27516DRSR  [S-PWSON-N6]
L4  220uH  [CDRH127]
R76  806K  [R_0805]
R77  10K  [R_0805]
R78  220R  [R_0402]
R79  220R  [R_0402]
R80  220R  [R_0402]
VD1  RS1J  [SMA]
VT16  4N65D  [TO-252-2L]

### Ports
PWM-NEG (in), PWM-POS (in), PWM-V-FB (in), VDD-IN (in), VDD-OUT (in)

### Nets
GND: C33.2 C34.2 C35.2 C36.2 C37.2 D5.2(GND) D5.3(GND) D5.PAD R77.2 VT16.2(S)
VDD-IN: C35.1 C37.1 D5.4(VDD) L4.1 ; port VDD-IN  [project net VDD-VBUS]
VDD-OUT: C33.1 C34.1 R76.1 VD1.1(K) ; port VDD-OUT  [project net VDD-NIXIE]
BRD-DCBOOST-PWM-NEG: R80.2 ; port PWM-NEG
BRD-DCBOOST-PWM-POS: R79.2 ; port PWM-POS
BRD-DCBOOST-V-FB: C36.1 R76.2 R77.1 ; port PWM-V-FB
NetD5_1: D5.1(IN-) R80.1
NetD5_5: D5.5(OUT) R78.2
NetD5_6: D5.6(IN+) R79.1
NetL4_2: L4.2 VD1.2(A) VT16.3(D)
NetR78_1: R78.1 VT16.1(G)

### Notes on the sheet
- Подп. и дата
- Инв. № дубл.
- Взам. инв. №
- Symbol name: =SheetSymbolDesignator
  File name: =DocumentName
  Variant name (Short): =ProjectVariant ( =ProjectBoardVariant )
  Version on board: =ProjectRevisionCode
- Инв. № подл.
- Изм.
- Лист
- № докум.
- Подп.
- Дата
- 2.106-A4
- Копировал
- Формат А4
- (in symbol UCC27516DRSR) GATE; DRIVER

### Library data of the parts
C33 = 1210-X7R-250V-0.1uF±10%: Manufacturer: Yageo; NameFromManufacturer: CC1210KKX7RYBB104; Place: S; Voltage: 250V; Tolerance: 10%; Check: False; Part Number: 1210-X7R-250V-0.1uF±10%; Value: 0.1uF; Temperature: -55°C~125°C; ComponentLink2Description: Link to datasheet; ComponentLink1Description: DATASHEET; ComponentLink2URL: https://www.electronshik.ru/item/YAG/CC1210KKX7RYBB104; ComponentLink1URL: Datasheets/capacitors/UPY-GPHC_X7R_6.3V-to-250V_22.pdf#Datasheets/capacitors/UPY-GPHC_X7R_6.3V-to-250V_22.pdf#; Last changed: 15.11.2022
C34 = ECAPSMD-4.7UF-400V-20%-10000h: *; Manufacturer: Ymin; NameFromManufacturer: VKMD1002G4R7MV; Place: T; Voltage: 400V; Tolerance: 20%; Check: False; Part Number: ECAPSMD-4.7UF-400V-20%-10000h; Value: 4.7uF; Temperature: -40°C~105°C; ComponentLink2Description: Link to datasheet; ComponentLink1Description: DATASHEET; ComponentLink2URL: https://www.lcsc.com/product-detail/Aluminum-Electrolytic-Capacitors-SMD_Ymin-VKMD1002G4R7MV_C487561.html; Last changed: 21.01.2024
C35 = 1210-X7R-100V-2.2uF±10%: Manufacturer: Samsung Electro-Mechanics; NameFromManufacturer: CL32B225KCJSNNE; Place: S; Voltage: 100V; Tolerance: 10%; Check: False; Part Number: 1210-X7R-100V-2.2uF±10%; Value: 2.2uF; Temperature: -55°C~125°C; ComponentLink2Description: Link to datasheet; ComponentLink1Description: DATASHEET; ComponentLink2URL: https://www.digikey.com/en/products/detail/samsung-electro-mechanics/CL32B225KCJSNNE/3889020; ComponentLink1URL: Datasheets/capacitors/samsung_cl32b225kcjsnne.pdf; Last changed: 27.10.2022
C36 C37 = 0402-X7R-16V-0.1uF±10%: as C30 on sheet I2C-RTC; Part Number: 0402-X7R-16V-0.1uF±10%; Value: 0.1uF; Temperature: -55°C~125°C; ComponentLink2Description: Link to datasheet; ComponentLink1Description: DATASHEET; ComponentLink2URL: https://www.yageo.com/upload/media/product/productsearch/datasheet/mlcc/UPY-GPHC_X7R_6.3V-to-50V_18.pdf; ComponentLink1URL: Datasheets/capacitors/UPY-GPHC_X7R_6.3V-to-50V_18.pdf; Last changed: 27.10.2022
D5 = UCC27516DRSR: Low Side 4.5V~18V 4A SON-6(3x3) Gate Drive; Manufacturer: Texas Instruments; Place: T; Check: False; Part Number: UCC27516DRSR; Temperature: -40°C~140°C; Value: UCC27516DRSR; ComponentLink1Description: DATASHEET; NameFromManufacturer: UCC27516DRSR; ComponentLink1URL: https://www.lcsc.com/product-detail/Gate-Drive-ICs_Texas-Instruments-UCC27516DRSR_C3655221.html; Last changed: 21.01.2024
L4 = SLH1207S-221k-1.16A: *; Manufacturer: Sunltech Tech; NameFromManufacturer: SLH1207S221MTT; Place: T; Tolerance: 20%; Current: 1.16A; DC Resistance: 0.39R; Check: False; Part Number: SLH1207S-221k-1.16A; Value: 220uH; Temperature: -40°C~125°C; ComponentLink1Description: DATASHEET; ComponentLink1URL: https://www.lcsc.com/product-detail/Power-Inductors_Sunltech-Tech-SLH1207S221MTT_C182174.html; Last changed: 21.01.2024
R76 = 0805-0.125W-806K-100ppm±1%: *; NameFromManufacturer: RC0805FR-07806KL; Manufacturer: Yageo; Place: S; Tolerance: 1%; Check: False; Part Number: 0805-0.125W-806K-100ppm±1%; Value: 806K; Temperature: -55°C~125°C; ComponentLink1Description: DATASHEET; ComponentLink1URL: https://www.terraelectronica.ru/product/871864; Datasheet: Datasheets/resistors/PYu-RC_Group_51_RoHS_L_11.pdf; Last changed: 27.10.2022
R77 = 0805-0.125W-10K-200ppm±1%: as R28 on sheet I2C-NIXIE-CTRL; Part Number: 0805-0.125W-10K-200ppm±1%; Value: 10K; Temperature: -55°C~155°C; ComponentLink1Description: DATASHEET; ComponentLink1URL: https://static.chipdip.ru/lib/175/DOC011175144.pdf; Datasheet: Datasheets/resistors/PYu-RC_Group_51_RoHS_L_11.pdf; Last changed: 22.01.2024
R78-R80 = 0402-0.0625W-220R-100ppm±1%: as R30 on sheet I2C-NIXIE-CTRL; Part Number: 0402-0.0625W-220R-100ppm±1%; Value: 220R; Temperature: -55°C~155°C; ComponentLink1Description: DATASHEET; ComponentLink1URL: https://octopart.com/rc0402jr-07220rl-yageo-40254879?r=sp#Specs; Datasheet: Datasheets/resistors/RC0402.pdf; Last changed: 28.03.2023
VD1 = RS1J: 600V 1.3V@1A 250ns 1A SMA(DO-214AC) Switching Diode; Manufacturer: WPMtek; Place: T; Check: False; Part Number: RS1J; Value: RS1J; Temperature: -55°C~150°C; ComponentLink1Description: DATASHEET; NameFromManufacturer: RS1J; ComponentLink1URL: https://www.lcsc.com/product-detail/Switching-Diode_WPMtek-Wei-Pan-Microelectronics-RS1J_C2766052.html; Last changed: 21.01.2024
VT16 = 4N65D: 650V 4A 2.5Ω TO-252 MOSFET / 650V 4A 2.5Ω TO-252 MOSFET; Manufacturer: MDD; NameFromManufacturer: MDD4N65D; Place: T; Check: False; Part Number: 4N65D; Voltage: 650V; Value: 4N65D; Temperature: -55°C~150°C; ComponentLink1Description: DATASHEET; ComponentLink1URL: https://www.lcsc.com/product-detail/MOSFETs_MDD-Microdiode-Electronics-MDD4N65D_C5299402.html; Last changeв: 21.01.2024

## Sheet RF-PCBF-2G4.SchDoc: =ProjectTitle
size 209 x 297 mm; Address1: Address1; Address2: Address2; Address3: Address3; Address4: Address4; DocumentNumber: PRJ-RETROCLOCK-PCBMAIN-1.0 Э3; SheetNumber: 8; SheetTotal: 9; Scale: 1:1; DocumentType: Схема электрическая принципиальная; FirstReferrence: RETROCLOCK
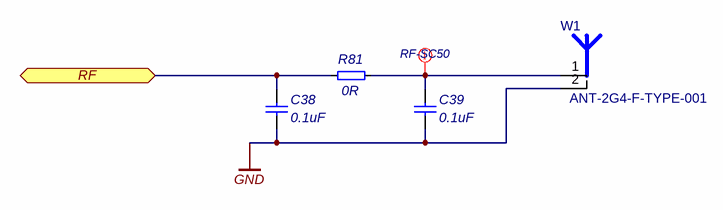
[diagram p7: RF-PCBF-2G4.SchDoc]

### Parts
C38  0.1uF  [C0402]
C39  0.1uF  [C0402]
R81  0R  [R_0402]
W1  ANT-2G4-F-TYPE-001  [ANT-2G4-F-TYPE-001]  (net tie, no BOM)

### Ports
RF (bidir)

### Nets
GND: C38.1 C39.1 W1.2(Fix_pad_2)
BRD-ANT: C38.2 R81.1 ; port RF
NetC39_2: C39.2 R81.2 W1.1(Out)

Not connected (* = marked no-connect by the designer): W1 3(Fix_pad_3) 4(Fix_pad_4)

### Layout directives
net class RF-SC50: NetC39_2

### Notes on the sheet
- Подп. и дата
- Инв. № дубл.
- Взам. инв. №
- Symbol name: =SheetSymbolDesignator
  File name: =DocumentName
  Variant name (Short): =ProjectVariant ( =ProjectBoardVariant )
  Version on board: =ProjectRevisionCode
- Инв. № подл.
- Изм.
- Лист
- № докум.
- Подп.
- Дата
- 2.106-A4
- Копировал
- Формат А4

### Library data of the parts
C38 C39 = 0402-X5R-50V-0.1uF±10%: as C3 on sheet Board; Part Number: 0402-X5R-50V-0.1uF±10%; Value: 0.1uF; Temperature: -55°C~85°C; ComponentLink2Description: Link to datasheet; ComponentLink1Description: DATASHEET; ComponentLink2URL: https://www.yageo.com/upload/media/product/productsearch/datasheet/mlcc/UPY-GPHC_X5R_4V-to-50V_26.pdf; ComponentLink1URL: Datasheets/capacitors/UPY-GPHC_X5R_4V-to-50V_26.pdf; Last changed: 27.10.2022
R81 = 0402-0.0625W-0R-100ppm±1%: NameFromManufacturer: RC0402FR-070RL; Manufacturer: Yageo; Place: S; Tolerance: 1%; Check: False; Part Number: 0402-0.0625W-0R-100ppm±1%; Value: 0R; Temperature: -55°C~155°C; ComponentLink1Description: DATASHEET; ComponentLink1URL: https://www.chipdip.ru/product0/8000617426?ysclid=l7og5x0plo427794326; Datasheet: Datasheets/resistors/DOC012445956.pdf; Last changed: 27.10.2022
W1 = ANT-2G4-F-TYPE-001: Antenna; Place: S; Check: False; ComponentLink1Description: DATASHEET; ComponentLink1URL: *; Part Number: ANT-2G4-F-TYPE-001; Value: ANT-2G4-F-TYPE-001; NameFromManufacturer: ANT-2G4-F-TYPE-001; Last changed: 27.10.2022

## Sheet RF-CON-NFC.SchDoc: =ProjectTitle
size 209 x 297 mm; Scale: 1:1; Address1: Address1; Address2: Address2; Address3: Address3; Address4: Address4; DocumentNumber: PRJ-RETROCLOCK-PCBMAIN-1.0 Э3; SheetNumber: 9; SheetTotal: 9; DocumentType: Схема электрическая принципиальная; FirstReferrence: RETROCLOCK
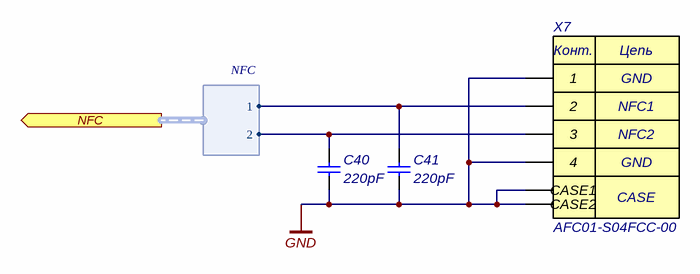
[diagram p8: RF-CON-NFC.SchDoc]

### Parts
C40  220pF  [C0402]
C41  220pF  [C0402]
X7  AFC01-S04FCC-00  [505110-0492]

### Ports
NFC (out, harness NFC)

### Harnesses
NFC: 1, 2

### Nets
GND: C40.2 C41.2 X7.1 X7.4 X7.CASE1 X7.CASE2
BRD-NFC.1: C41.1 X7.2 ; port NFC.1
BRD-NFC.2: C40.1 X7.3 ; port NFC.2

### Notes on the sheet
- GND
- NFC1
- NFC2
- Подп. и дата
- Инв. № дубл.
- Взам. инв. №
- Symbol name: =SheetSymbolDesignator
  File name: =DocumentName
  Variant name (Short): =ProjectVariant ( =ProjectBoardVariant )
  Version on board: =ProjectRevisionCode
- Инв. № подл.
- Изм.
- Лист
- № докум.
- Подп.
- Дата
- 2.106-A4
- Копировал
- Формат А4
- (in symbol AFC01-S04FCC-00) Конт.; Цепь; CASE

### Library data of the parts
C40 C41 = 0402-NP0-50V-220pF±5%: *; Manufacturer: Yageo; NameFromManufacturer: CC0402JRNPO9BN221; Place: S; Voltage: 50V; Tolerance: 5%; Check: False; Part Number: 0402-NP0-50V-220pF±5%; Value: 220pF; Temperature: -55°C~125°C; ComponentLink2Description: Link to datasheet; ComponentLink1Description: DATASHEET; ComponentLink2URL: https://octopart.com/cc0402jrnpo9bn221-yageo-42335946?r=sp#Specs; ComponentLink1URL: Datasheets/capacitors/MV.pdf; Last changed: 27.10.2022
X7 = AFC01-S04FCC-00: as X8 on sheet Board; Part Number: AFC01-S04FCC-00; Value: AFC01-S04FCC-00; Temperature: -25°C~85°C; ComponentLink1Description: DATASHEET; NameFromManufacturer: AFC01-S04FCC-00; ComponentLink1URL: https://www.lcsc.com/product-detail/FFC-FPC-Connectors_JUSHUO-AFC01-S04FCC-00_C262260.html; Last changed: 10.03.2024